# EAGLE design merge (EAGLE 7.5.0)

## Sheet 1 of 10

## Sheet 2 of 10
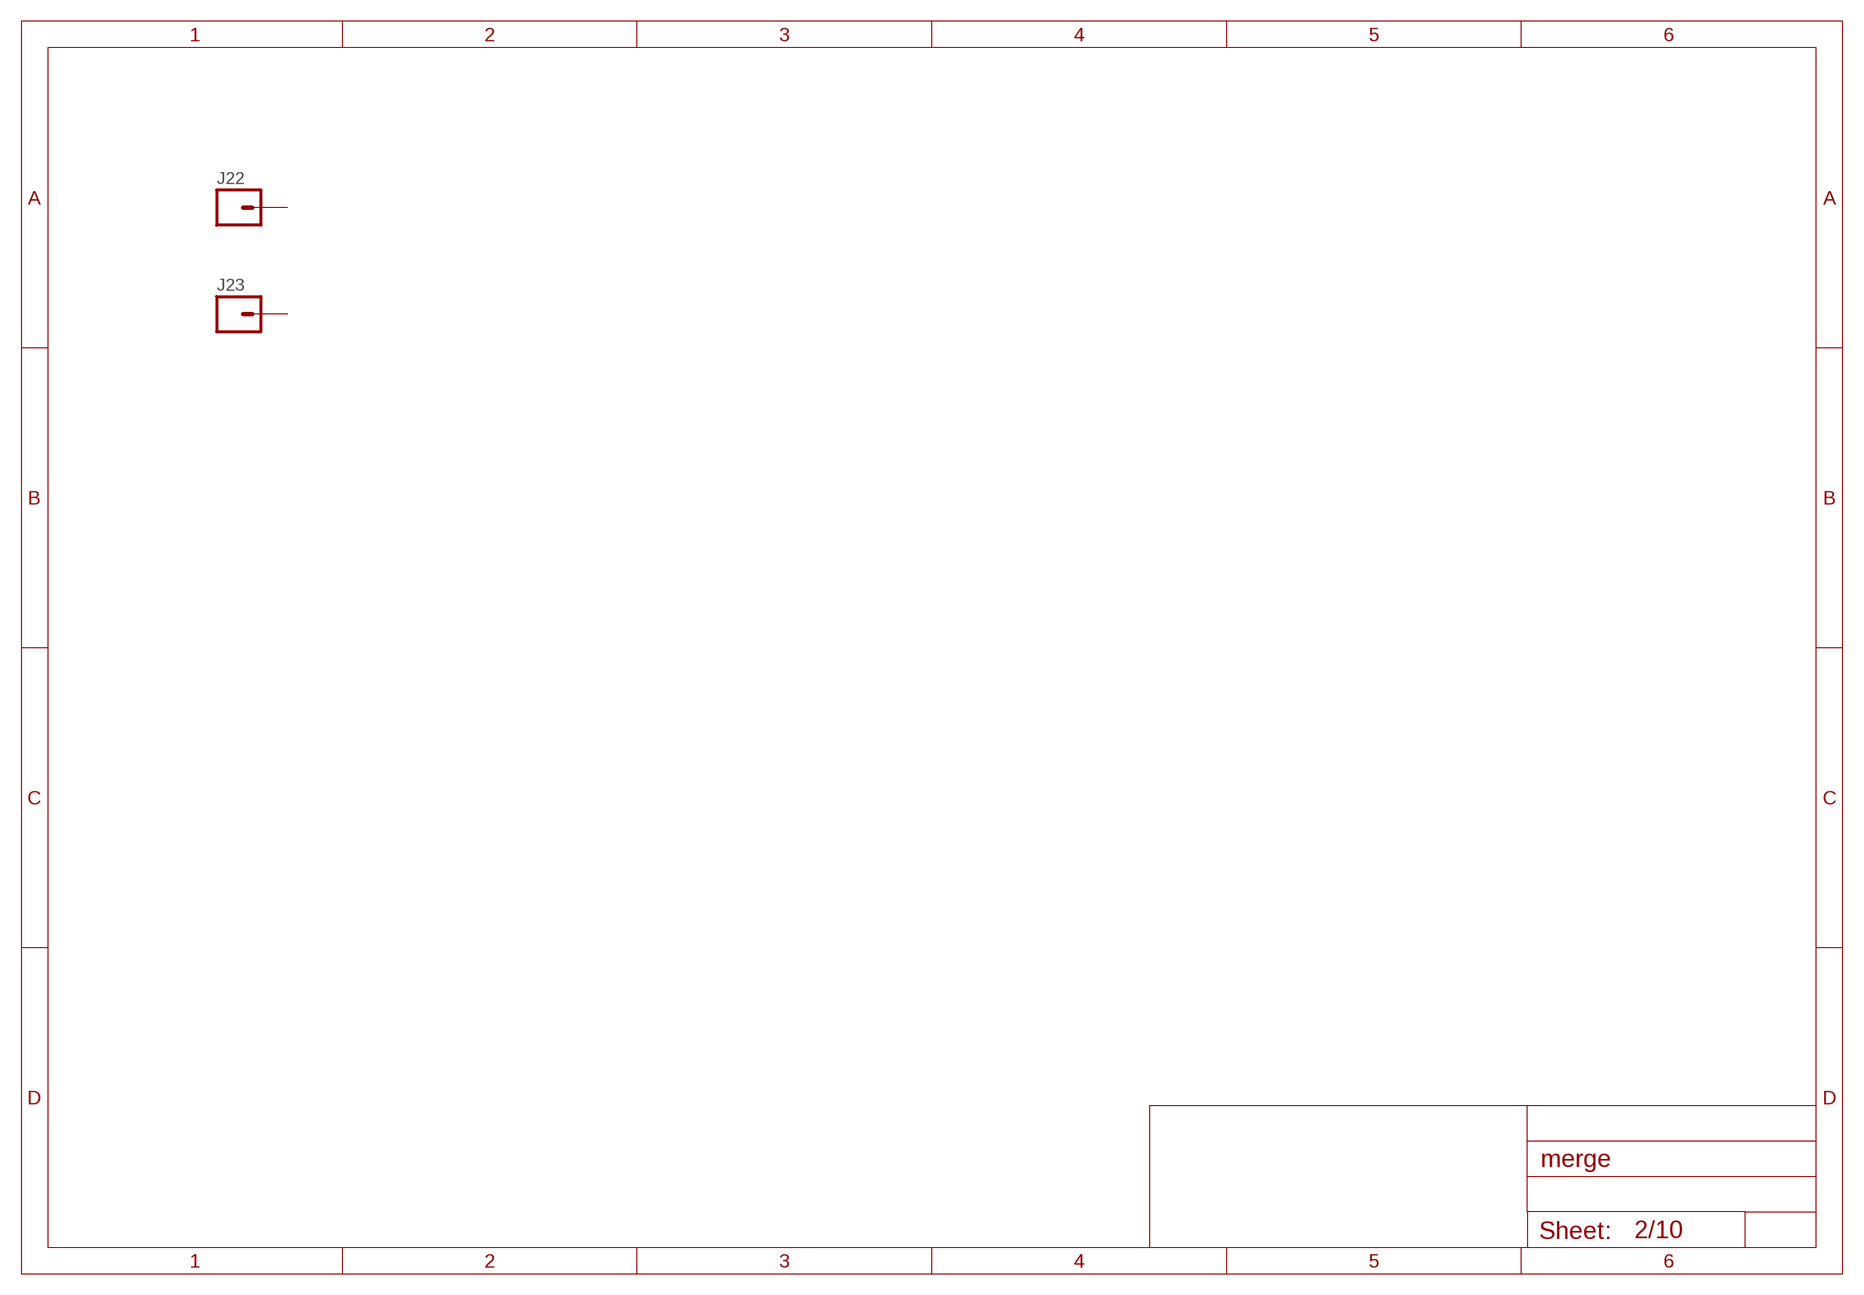
[diagram p0: schematic, sheet 2]

### Parts
J22  M01  [1X01_BIG]
J23  M01  [1X01_BIG]
Unconnected: J22.1 J23.1

## Sheet 3 of 10
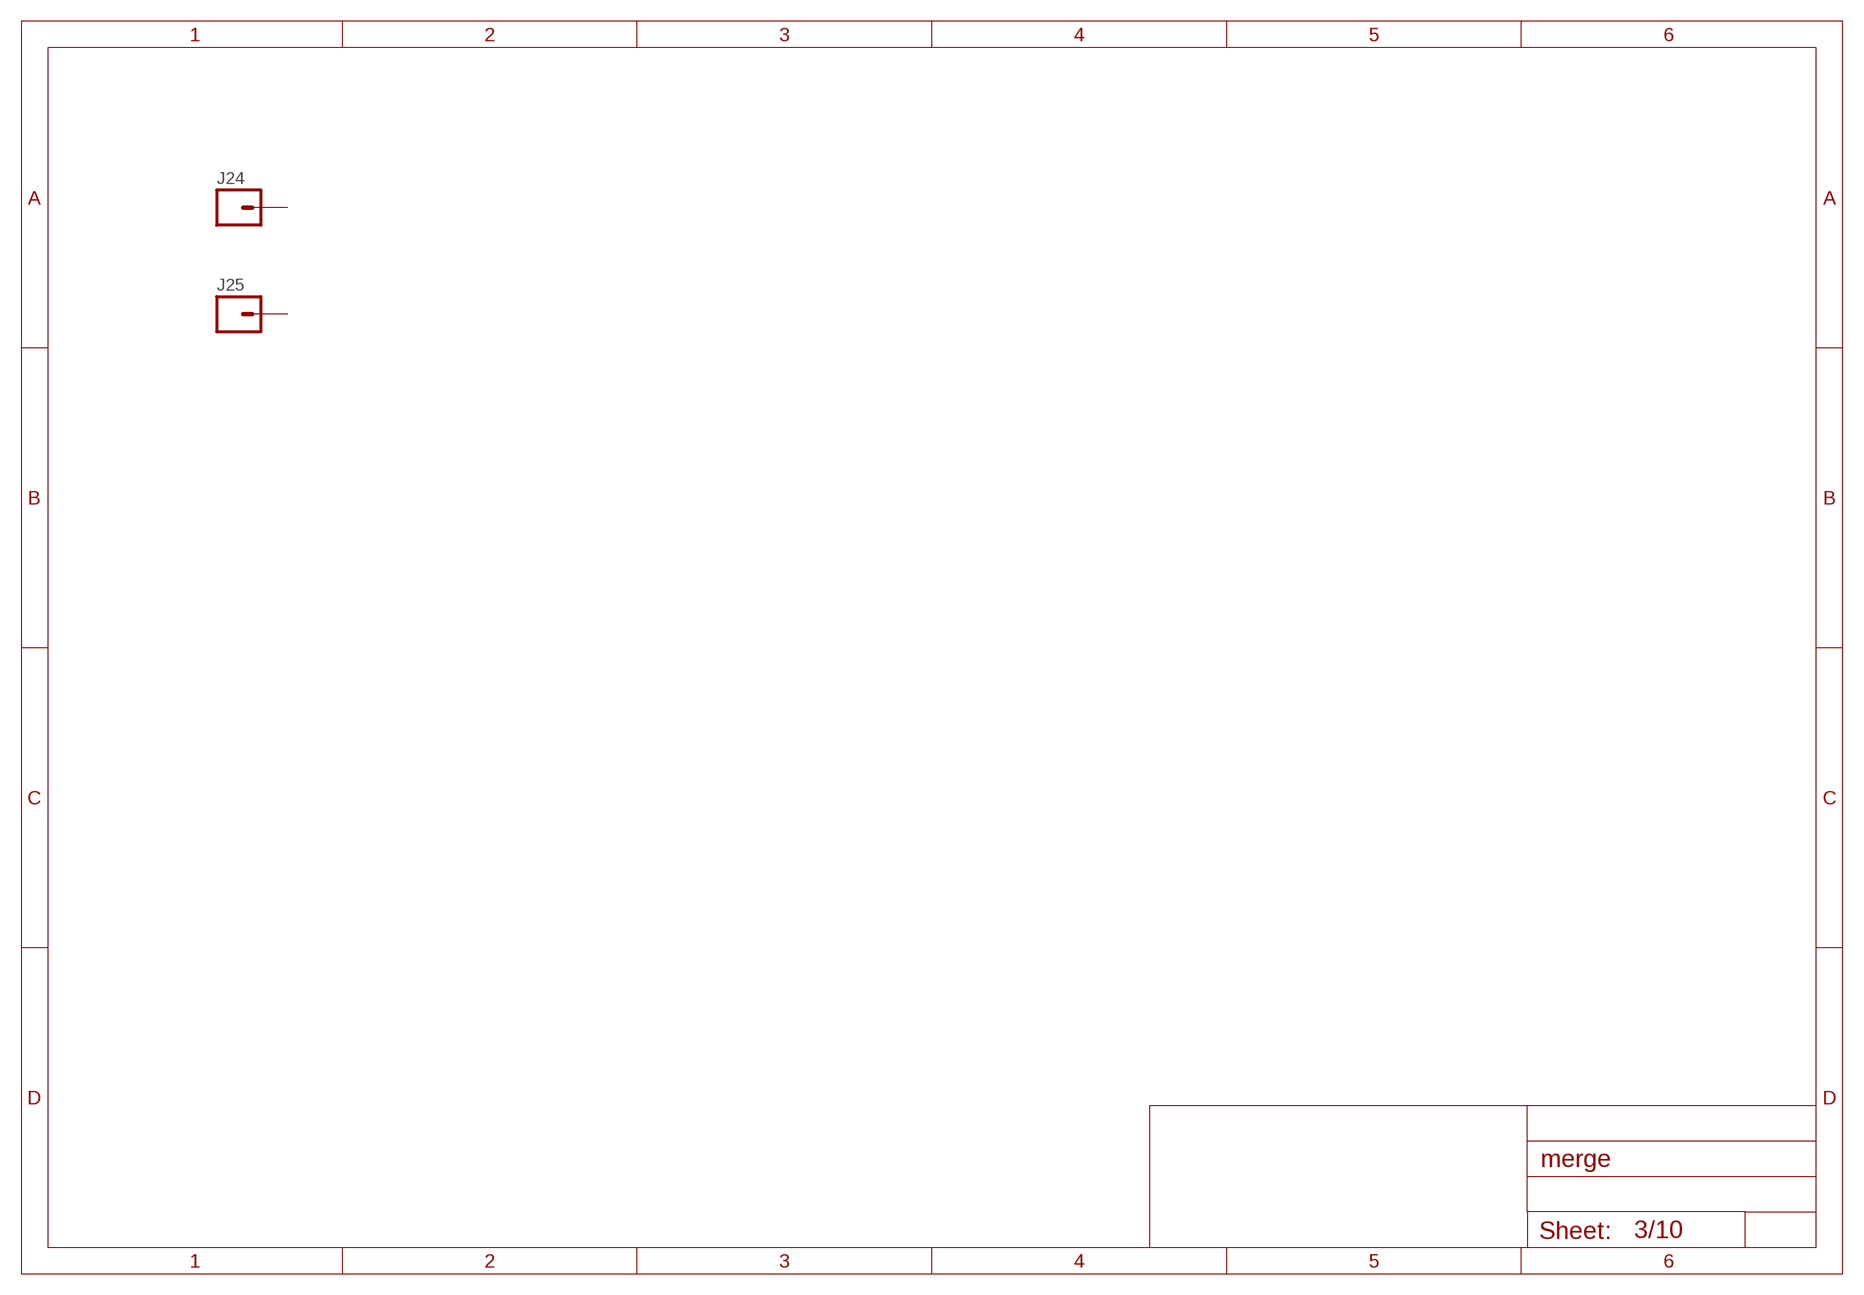
[diagram p1: schematic, sheet 3]

### Parts
J24  M01  [1X01_BIG]
J25  M01  [1X01_BIG]
Unconnected: J24.1 J25.1

## Sheet 4 of 10
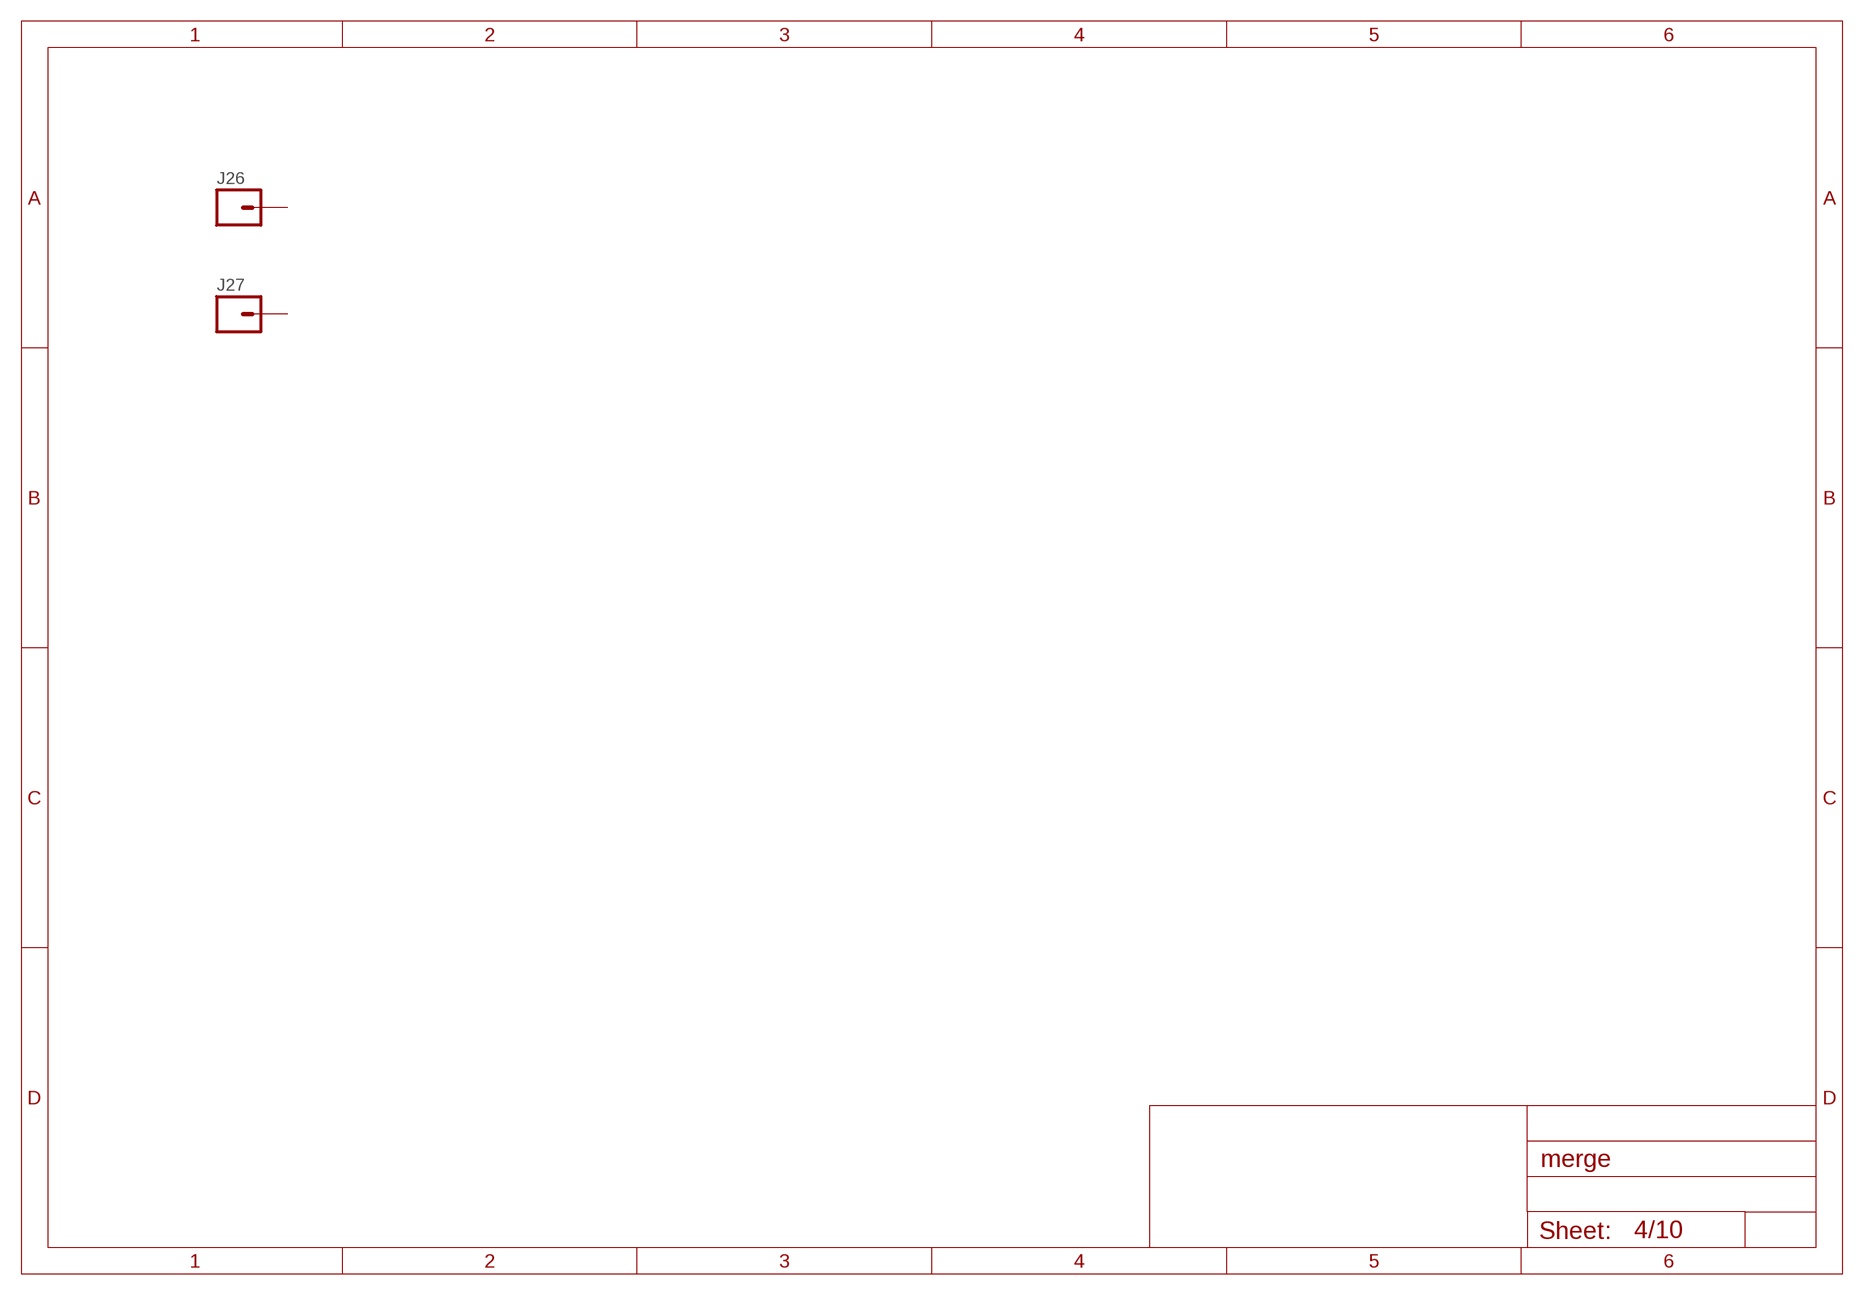
[diagram p2: schematic, sheet 4]

### Parts
J26  M01  [1X01_BIG]
J27  M01  [1X01_BIG]
Unconnected: J26.1 J27.1

## Sheet 5 of 10
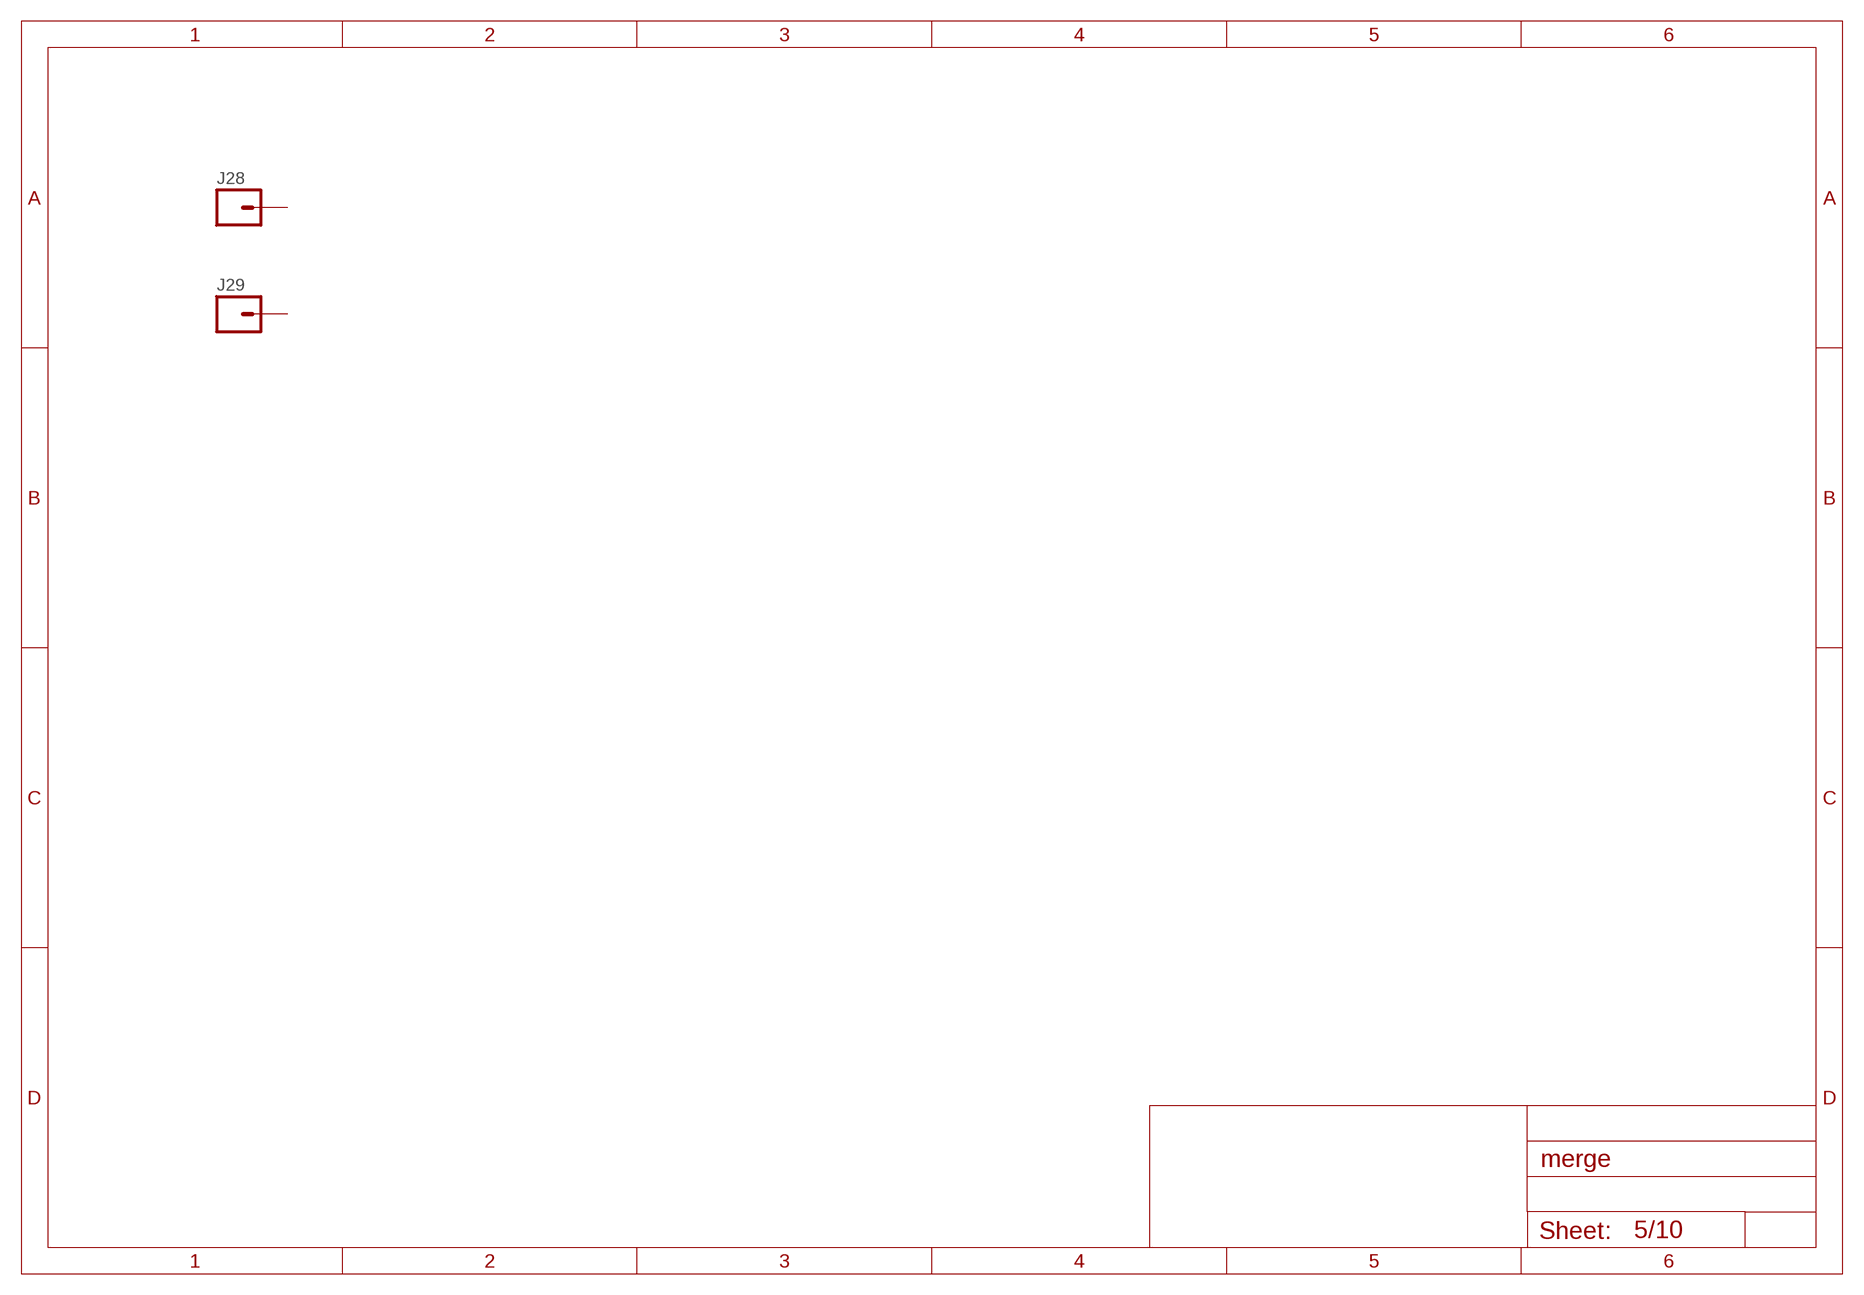
[diagram p3: schematic, sheet 5]

### Parts
J28  M01  [1X01_BIG]
J29  M01  [1X01_BIG]
Unconnected: J28.1 J29.1

## Sheet 6 of 10
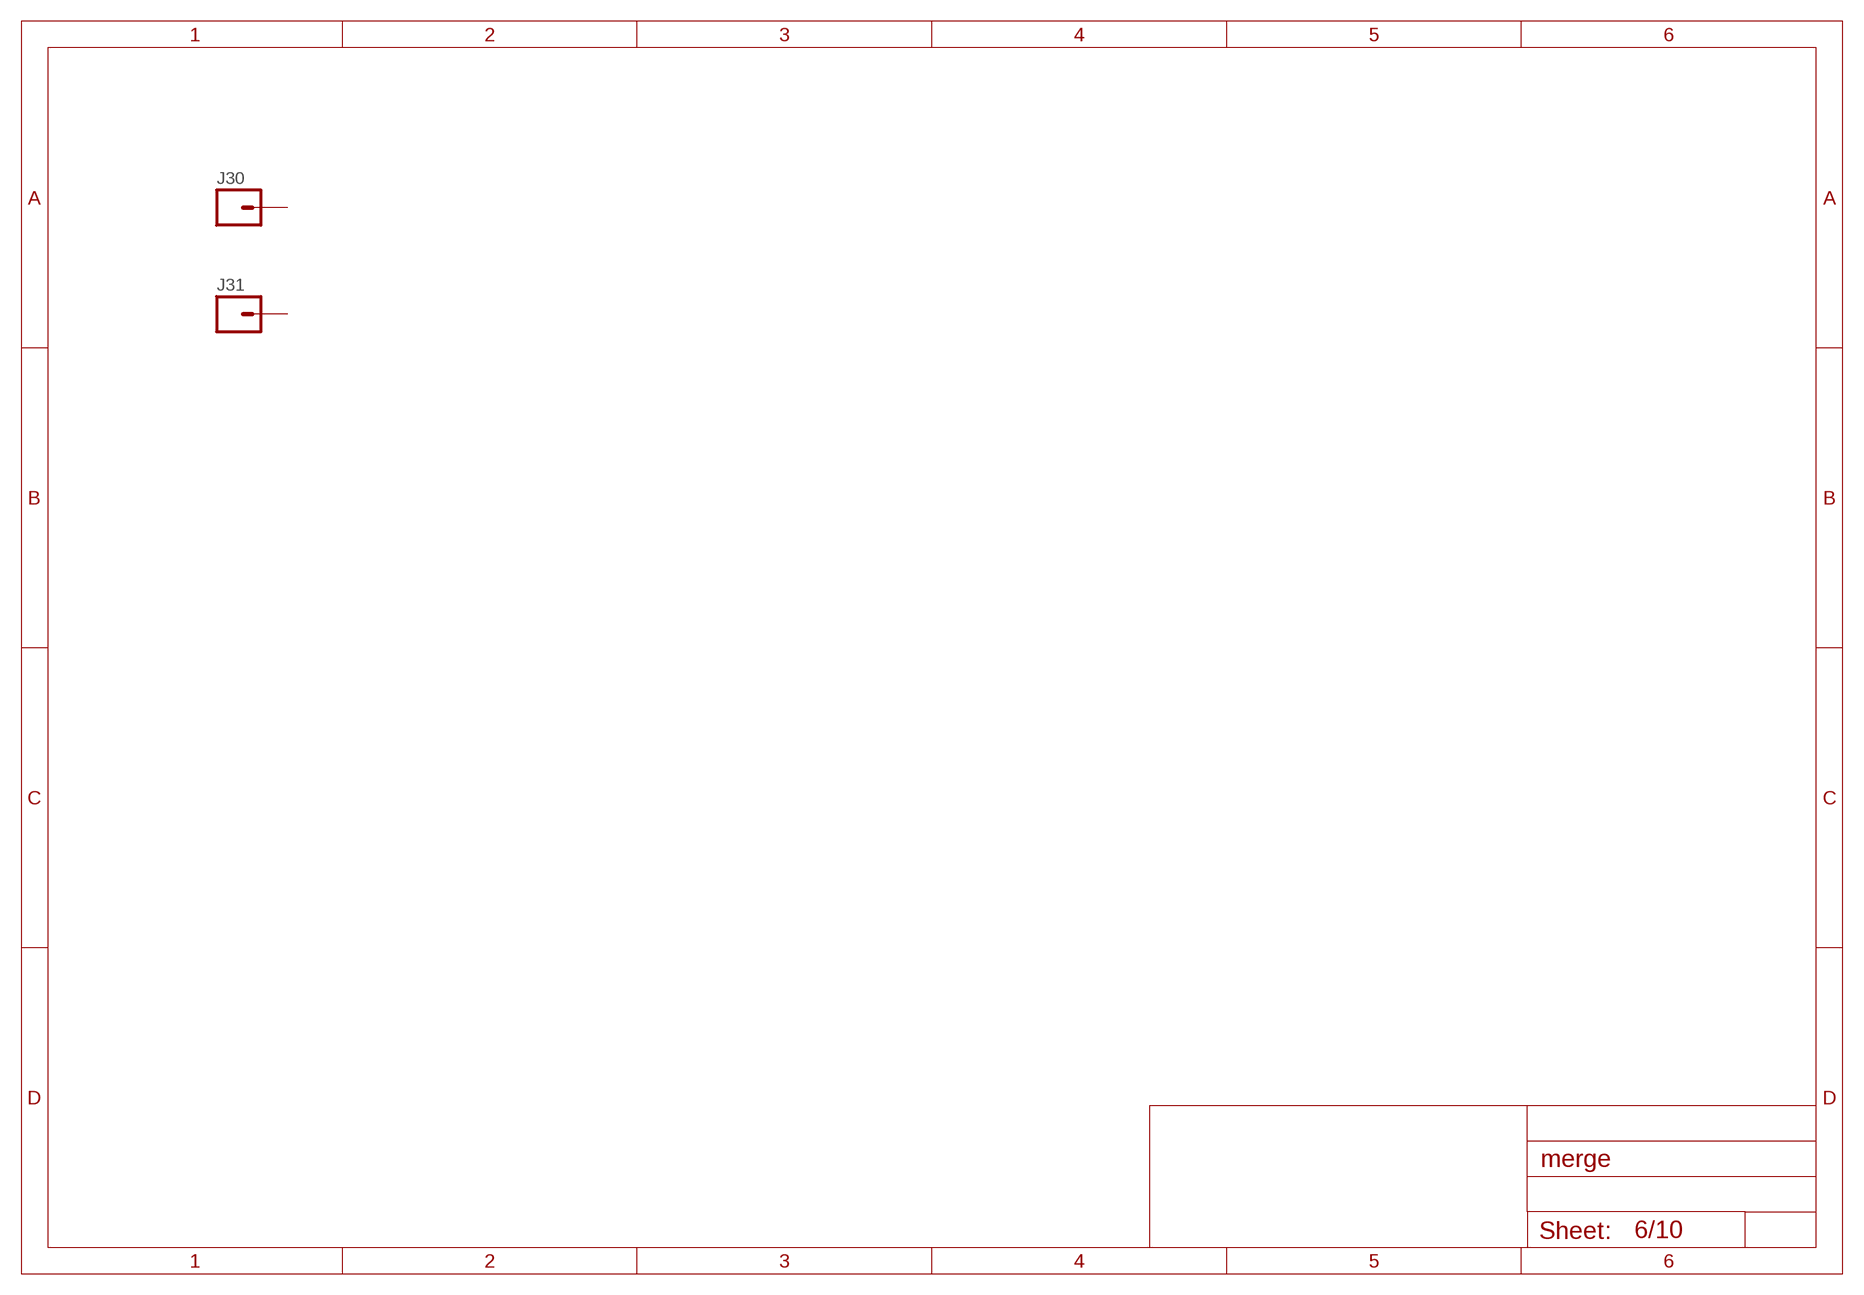
[diagram p4: schematic, sheet 6]

### Parts
J30  M01  [1X01_BIG]
J31  M01  [1X01_BIG]
Unconnected: J30.1 J31.1

## Sheet 7 of 10
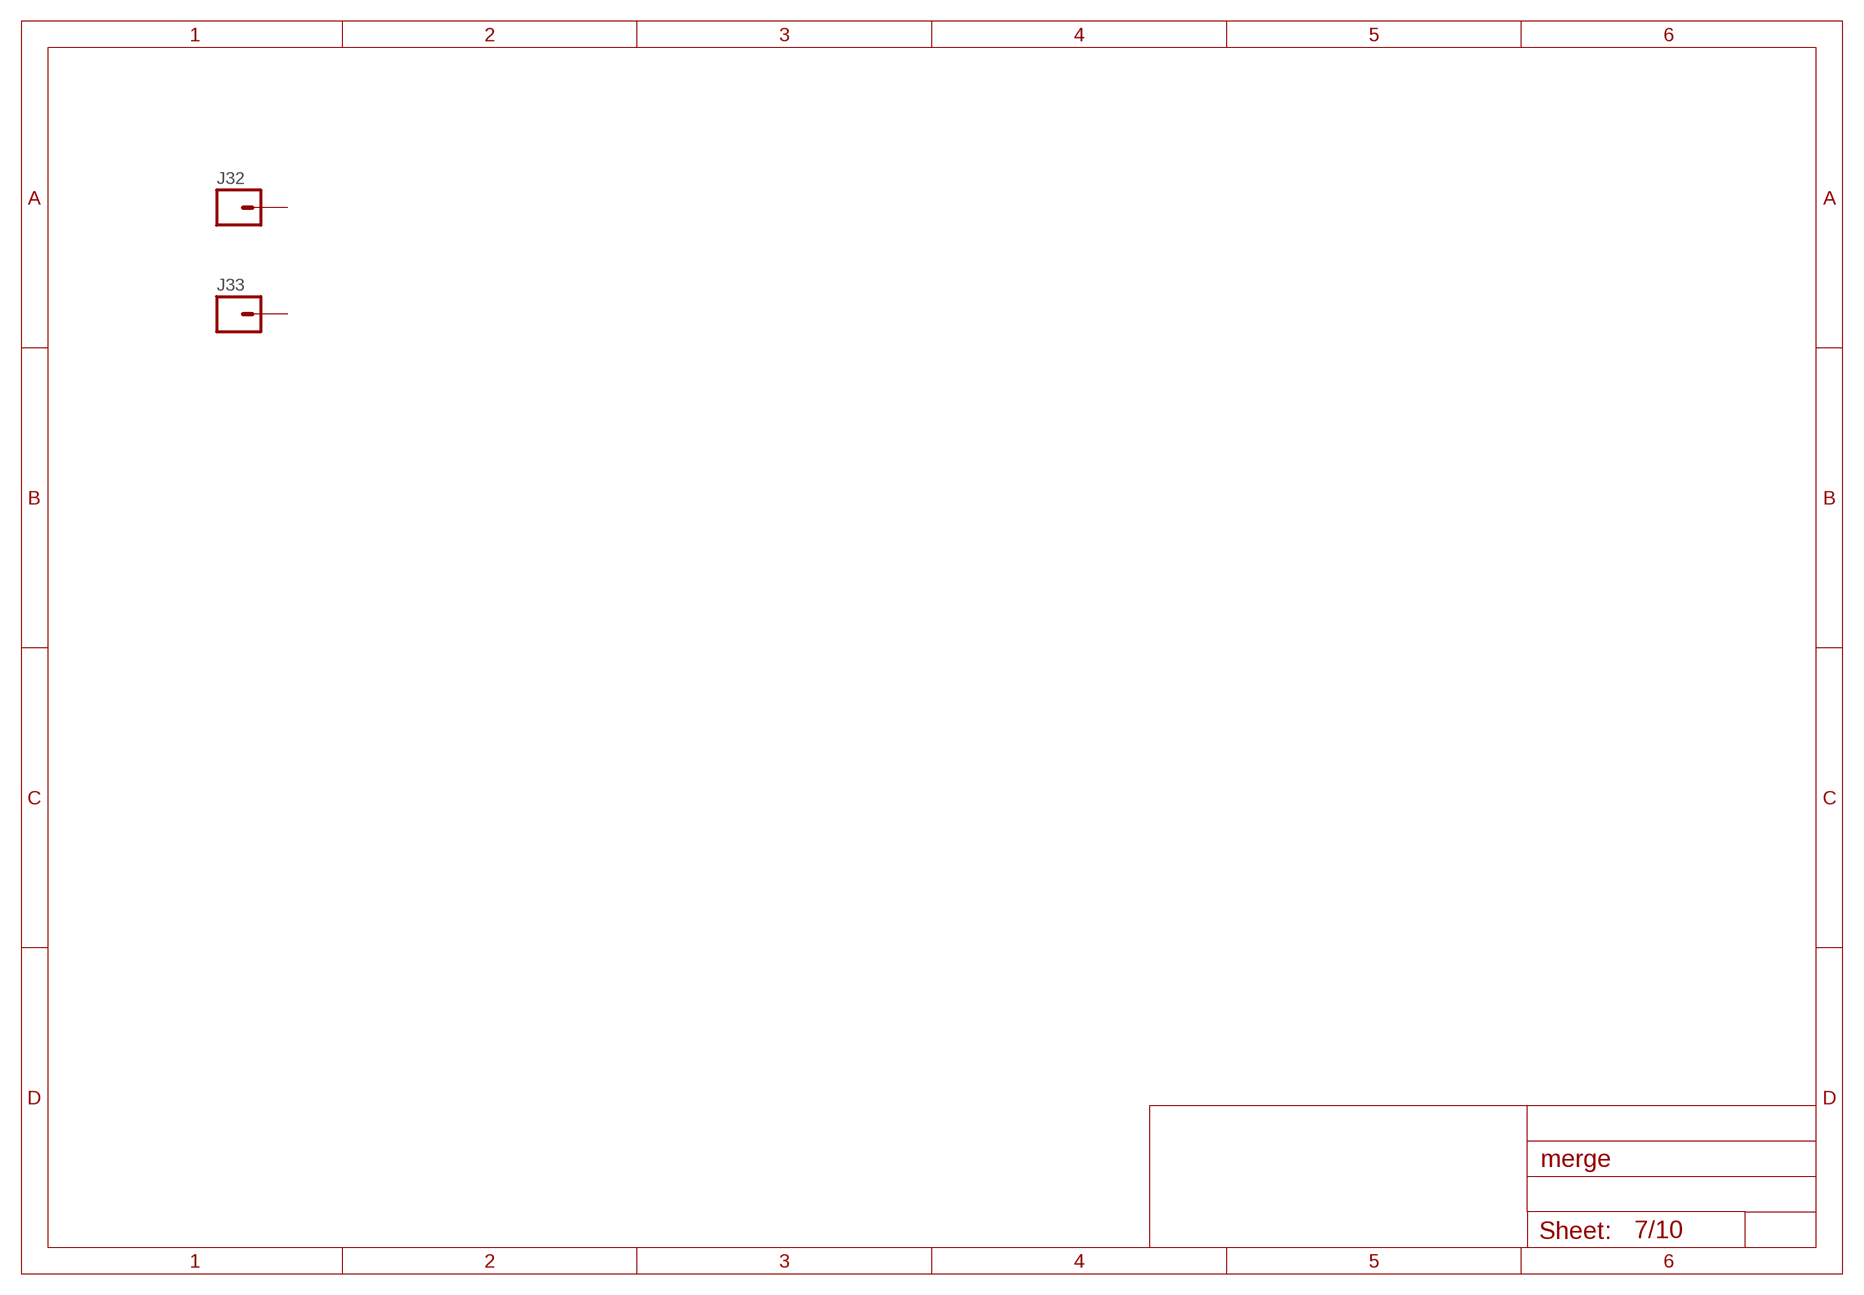
[diagram p5: schematic, sheet 7]

### Parts
J32  M01  [1X01_BIG]
J33  M01  [1X01_BIG]
Unconnected: J32.1 J33.1

## Sheet 8 of 10
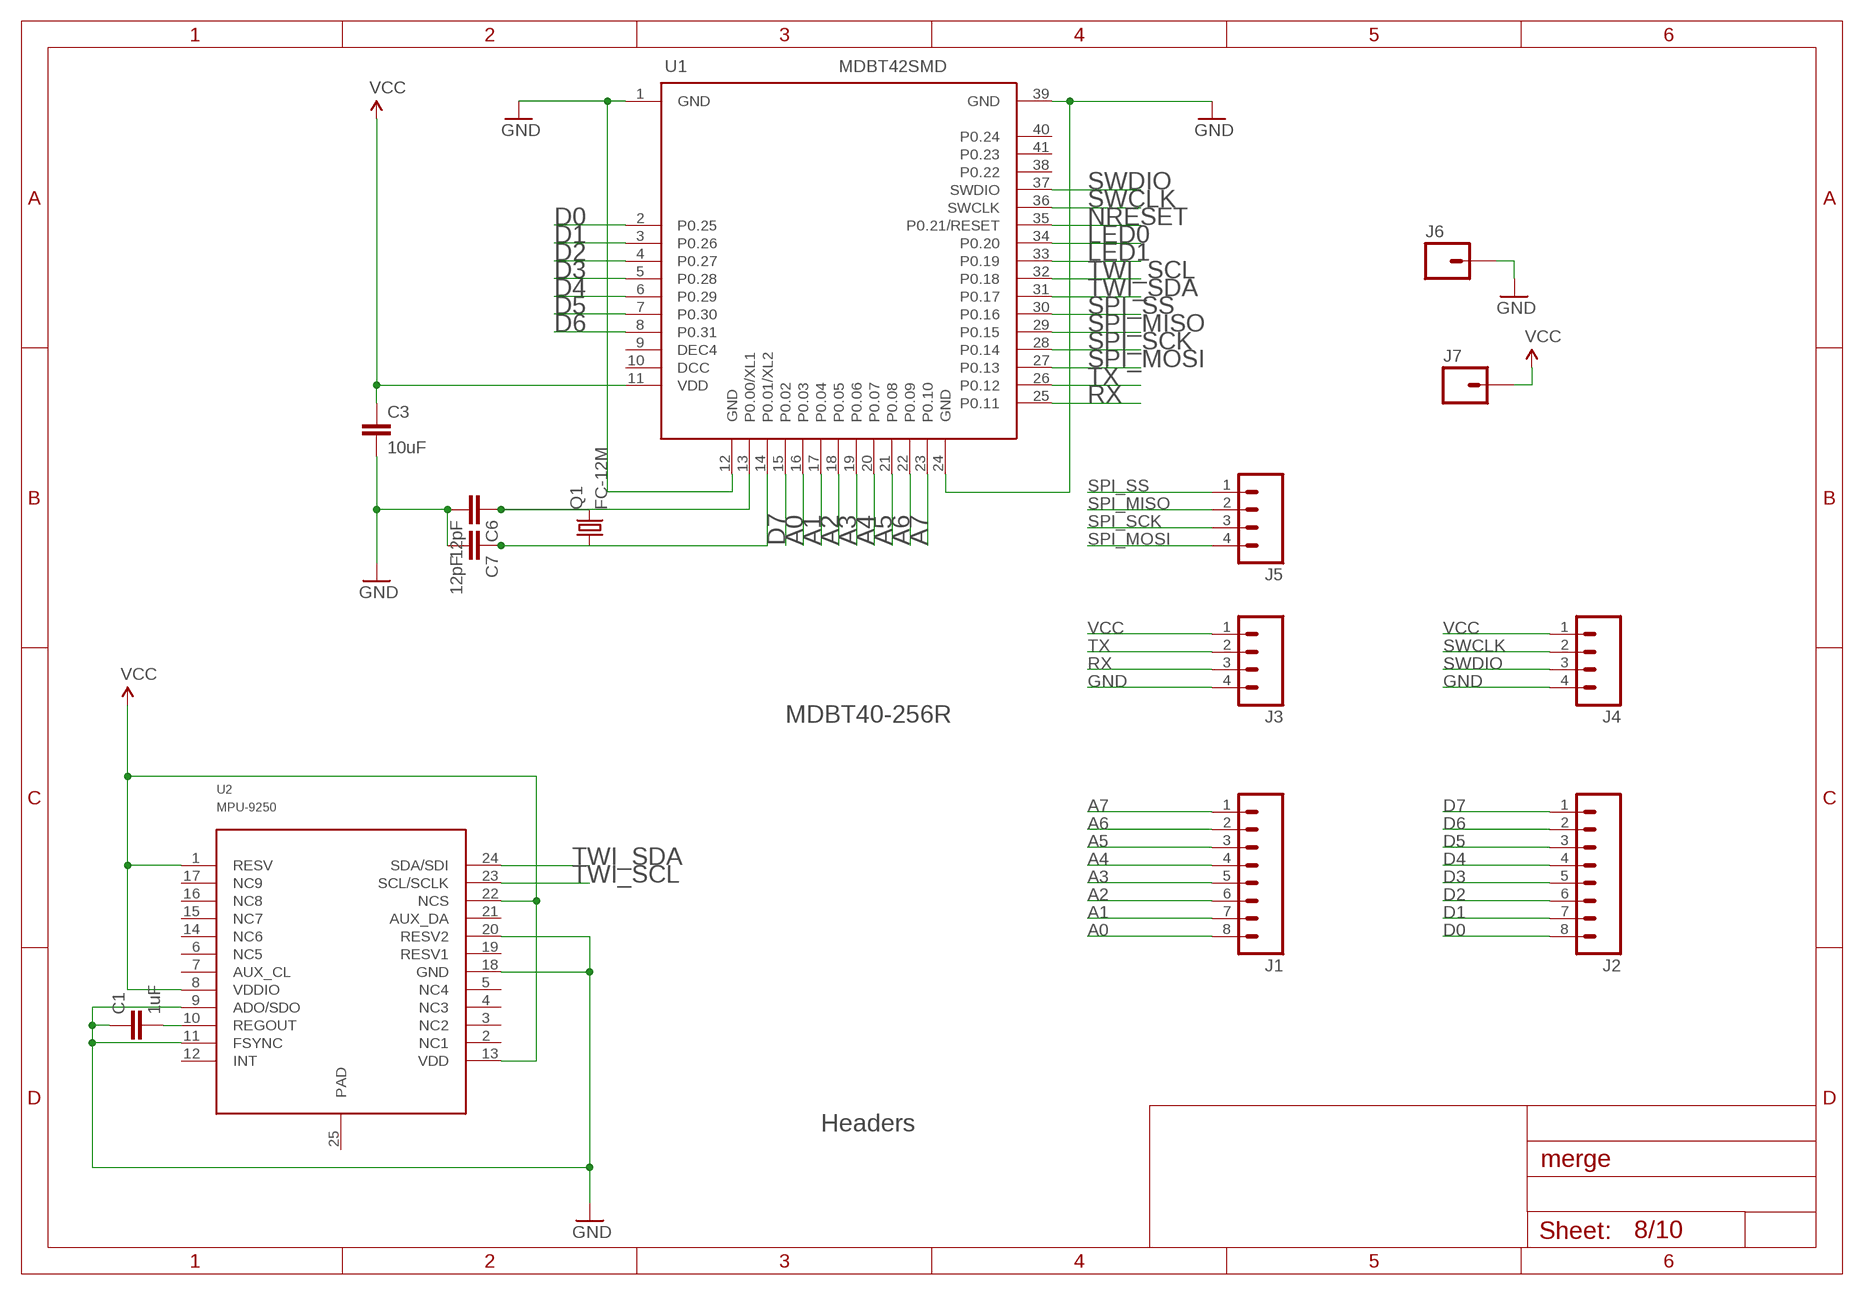
[diagram p6: schematic, sheet 8]

### Parts
C1  1uF  CAP0603-CAP  [0603-CAP]
C3  10uF  CAP0603-CAP  [0603-CAP]
C6  12pF  CAP0603-CAP  [0603-CAP]
C7  12pF  CAP0603-CAP  [0603-CAP]
J1  M08SILK_FEMALE_PTH  [1X08]
J2  M08SILK_FEMALE_PTH  [1X08]
J3  M04PTH  [1X04]
J4  M04PTH  [1X04]
J5  M04PTH  [1X04]
J6  M01_SMDSMD_4X2  [1X01_SMD]
J7  M01_SMDSMD_4X2  [1X01_SMD]
Q1  FC-12M  [FC-12M]
U1  MDBT42SMD  [MDBT42]
U2  MPU-9250  [LEAD-QFN24]

### Nets
A0: J1.8 U1.16(P0.03) ; also sheet 9,10
A1: J1.7 U1.17(P0.04) ; also sheet 9,10
A2: J1.6 U1.18(P0.05) ; also sheet 9,10
A3: J1.5 U1.19(P0.06) ; also sheet 9,10
A4: J1.4 U1.20(P0.07) ; also sheet 9,10
A5: J1.3 U1.21(P0.08) ; also sheet 9,10
A6: J1.2 U1.22(P0.09) ; also sheet 9,10
A7: J1.1 U1.23(P0.10) ; also sheet 9,10
D0: J2.8 U1.2(P0.25) ; also sheet 9,10
D1: J2.7 U1.3(P0.26) ; also sheet 9,10
D2: J2.6 U1.4(P0.27) ; also sheet 9,10
D3: J2.5 U1.5(P0.28) ; also sheet 9,10
D4: J2.4 U1.6(P0.29) ; also sheet 9,10
D5: J2.3 U1.7(P0.30) ; also sheet 9,10
D6: J2.2 U1.8(P0.31) ; also sheet 9,10
D7: J2.1 U1.15(P0.02) ; also sheet 9,10
GND: C1.1 C3.2 C6.2 C7.2 J3.4 J4.4 J6.P$1 U1.1(GND) U1.12(GND) U1.24(GND) U1.39(GND) U2.9(ADO/SDO) U2.11(FSYNC) U2.18(GND) U2.20(RESV2) ; also sheet 9,10
LED0: U1.34(P0.20) ; also sheet 9,10
LED1: U1.33(P0.19) ; also sheet 9,10
N$2: C7.1 Q1.1 U1.14(P0.01/XL2)
N$3: C6.1 Q1.2 U1.13(P0.00/XL1)
N$5: C1.2 U2.10(REGOUT)
NRESET: U1.35(P0.21/RESET) ; also sheet 9,10
RX: J3.3 U1.25(P0.11) ; also sheet 9,10
SPI_MISO: J5.2 U1.29(P0.15) ; also sheet 9,10
SPI_MOSI: J5.4 U1.27(P0.13) ; also sheet 9,10
SPI_SCK: J5.3 U1.28(P0.14) ; also sheet 9,10
SPI_SS: J5.1 U1.30(P0.16) ; also sheet 9,10
SWCLK: J4.2 U1.36(SWCLK) ; also sheet 9,10
SWDIO: J4.3 U1.37(SWDIO) ; also sheet 9,10
TWI_SCL: U1.32(P0.18) U2.23(SCL/SCLK) ; also sheet 9,10
TWI_SDA: U1.31(P0.17) U2.24(SDA/SDI) ; also sheet 9,10
TX: J3.2 U1.26(P0.12) ; also sheet 9,10
VCC: C3.1 J3.1 J4.1 J7.P$1 U1.11(VDD) U2.1(RESV) U2.8(VDDIO) U2.13(VDD) U2.22(NCS) ; also sheet 9,10
Unconnected: U1.9(DEC4) U1.10(DCC) U1.38(P0.22) U1.40(P0.24) U1.41(P0.23) U2.2(NC1) U2.3(NC2) U2.4(NC3) U2.5(NC4) U2.6(NC5) U2.7(AUX_CL) U2.12(INT) U2.14(NC6) U2.15(NC7) U2.16(NC8) U2.17(NC9) U2.19(RESV1) U2.21(AUX_DA) U2.25(PAD)

### Notes on the sheet
- MDBT40-256R
- Headers

## Sheet 9 of 10
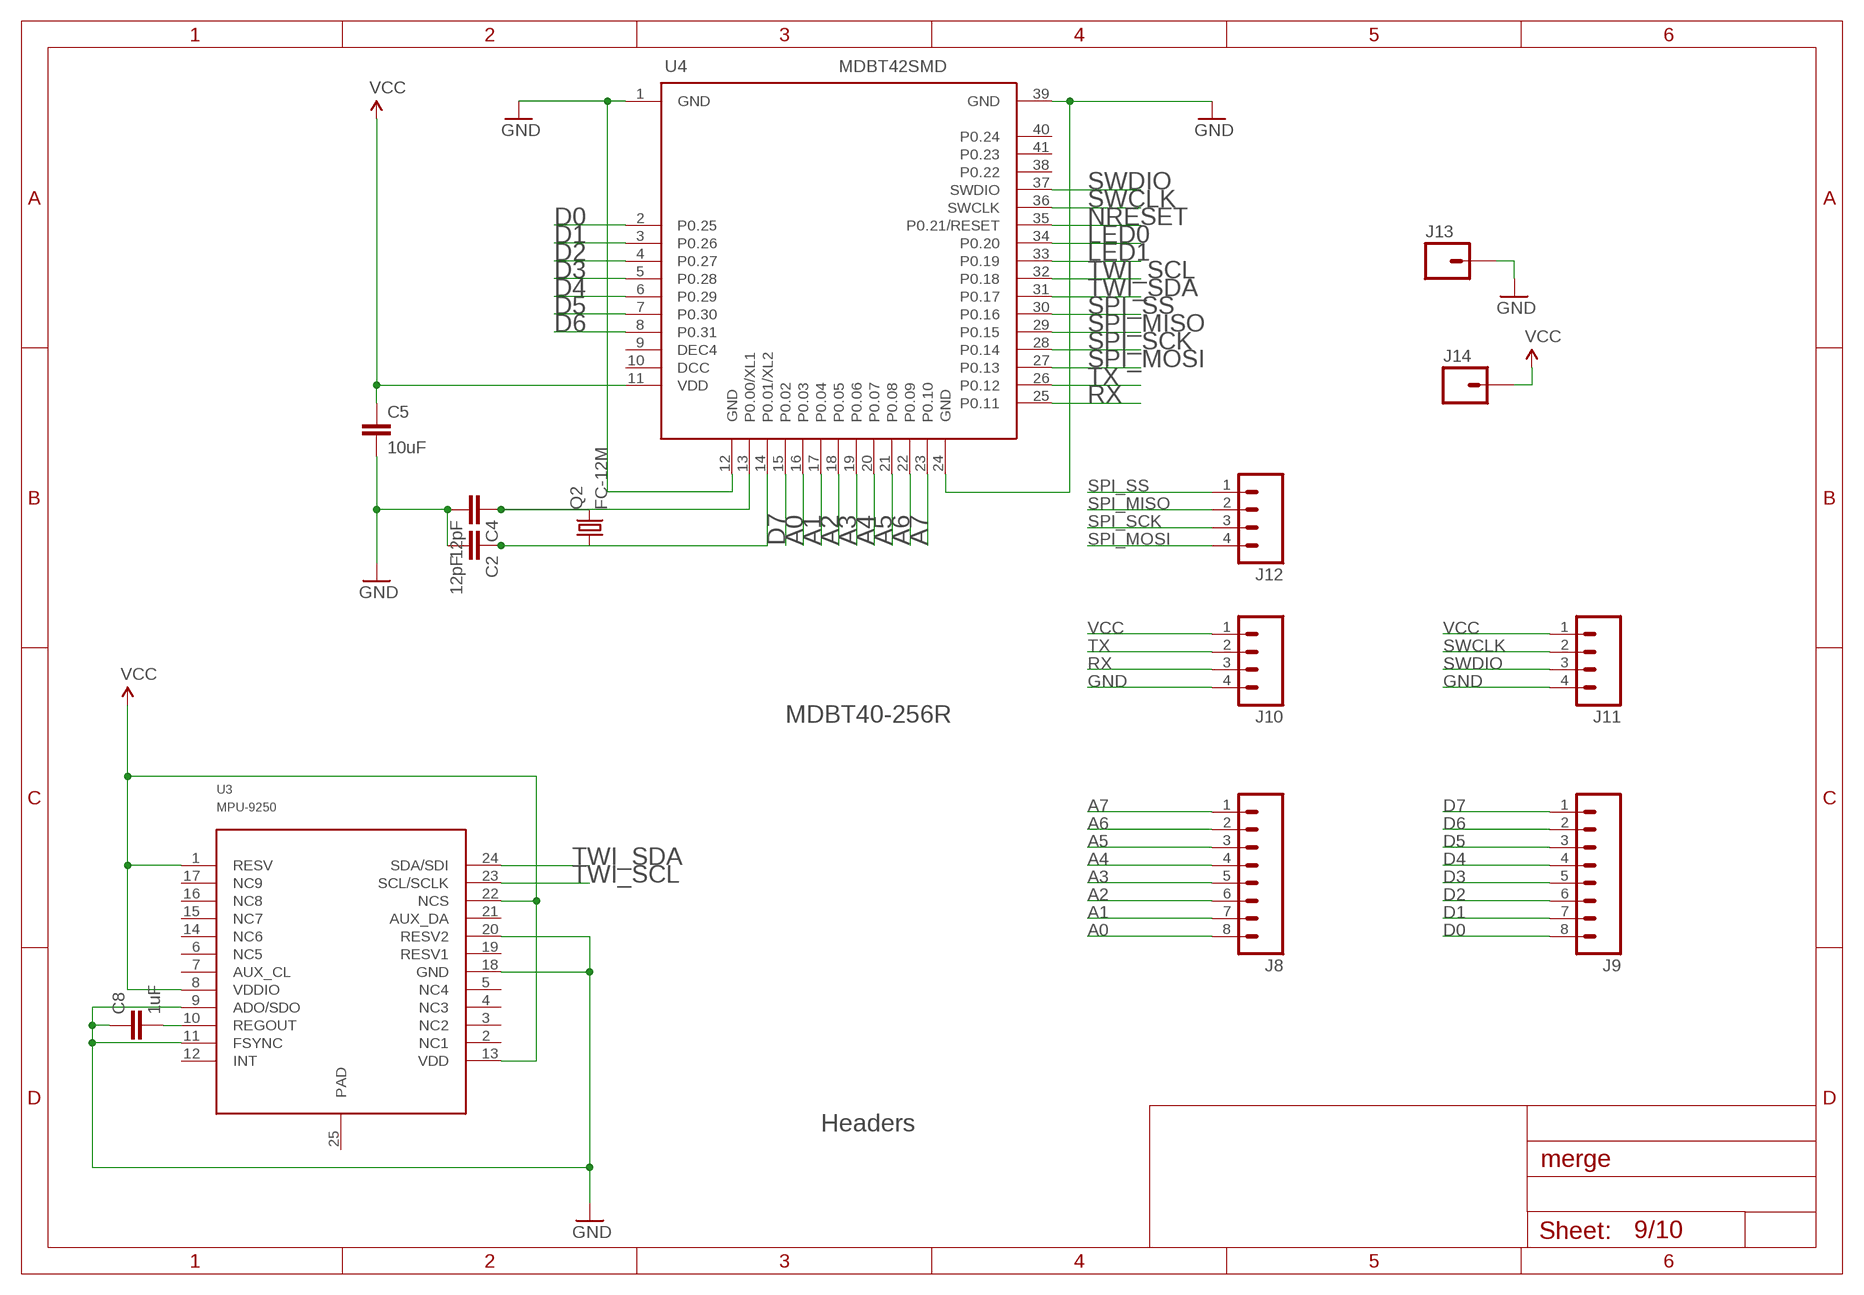
[diagram p7: schematic, sheet 9]

### Parts
C2  12pF  CAP0603-CAP  [0603-CAP]
C4  12pF  CAP0603-CAP  [0603-CAP]
C5  10uF  CAP0603-CAP  [0603-CAP]
C8  1uF  CAP0603-CAP  [0603-CAP]
J8  M08SILK_FEMALE_PTH  [1X08]
J9  M08SILK_FEMALE_PTH  [1X08]
J10  M04PTH  [1X04]
J11  M04PTH  [1X04]
J12  M04PTH  [1X04]
J13  M01_SMDSMD_4X2  [1X01_SMD]
J14  M01_SMDSMD_4X2  [1X01_SMD]
Q2  FC-12M  [FC-12M]
U3  MPU-9250  [LEAD-QFN24]
U4  MDBT42SMD  [MDBT42]

### Nets
A0: J8.8 U4.16(P0.03) ; also sheet 8,10
A1: J8.7 U4.17(P0.04) ; also sheet 8,10
A2: J8.6 U4.18(P0.05) ; also sheet 8,10
A3: J8.5 U4.19(P0.06) ; also sheet 8,10
A4: J8.4 U4.20(P0.07) ; also sheet 8,10
A5: J8.3 U4.21(P0.08) ; also sheet 8,10
A6: J8.2 U4.22(P0.09) ; also sheet 8,10
A7: J8.1 U4.23(P0.10) ; also sheet 8,10
D0: J9.8 U4.2(P0.25) ; also sheet 8,10
D1: J9.7 U4.3(P0.26) ; also sheet 8,10
D2: J9.6 U4.4(P0.27) ; also sheet 8,10
D3: J9.5 U4.5(P0.28) ; also sheet 8,10
D4: J9.4 U4.6(P0.29) ; also sheet 8,10
D5: J9.3 U4.7(P0.30) ; also sheet 8,10
D6: J9.2 U4.8(P0.31) ; also sheet 8,10
D7: J9.1 U4.15(P0.02) ; also sheet 8,10
GND: C2.2 C4.2 C5.2 C8.1 J10.4 J11.4 J13.P$1 U3.9(ADO/SDO) U3.11(FSYNC) U3.18(GND) U3.20(RESV2) U4.1(GND) U4.12(GND) U4.24(GND) U4.39(GND) ; also sheet 8,10
LED0: U4.34(P0.20) ; also sheet 8,10
LED1: U4.33(P0.19) ; also sheet 8,10
N$64: C2.1 Q2.1 U4.14(P0.01/XL2)
N$100: C4.1 Q2.2 U4.13(P0.00/XL1)
N$101: C8.2 U3.10(REGOUT)
NRESET: U4.35(P0.21/RESET) ; also sheet 8,10
RX: J10.3 U4.25(P0.11) ; also sheet 8,10
SPI_MISO: J12.2 U4.29(P0.15) ; also sheet 8,10
SPI_MOSI: J12.4 U4.27(P0.13) ; also sheet 8,10
SPI_SCK: J12.3 U4.28(P0.14) ; also sheet 8,10
SPI_SS: J12.1 U4.30(P0.16) ; also sheet 8,10
SWCLK: J11.2 U4.36(SWCLK) ; also sheet 8,10
SWDIO: J11.3 U4.37(SWDIO) ; also sheet 8,10
TWI_SCL: U3.23(SCL/SCLK) U4.32(P0.18) ; also sheet 8,10
TWI_SDA: U3.24(SDA/SDI) U4.31(P0.17) ; also sheet 8,10
TX: J10.2 U4.26(P0.12) ; also sheet 8,10
VCC: C5.1 J10.1 J11.1 J14.P$1 U3.1(RESV) U3.8(VDDIO) U3.13(VDD) U3.22(NCS) U4.11(VDD) ; also sheet 8,10
Unconnected: U3.2(NC1) U3.3(NC2) U3.4(NC3) U3.5(NC4) U3.6(NC5) U3.7(AUX_CL) U3.12(INT) U3.14(NC6) U3.15(NC7) U3.16(NC8) U3.17(NC9) U3.19(RESV1) U3.21(AUX_DA) U3.25(PAD) U4.9(DEC4) U4.10(DCC) U4.38(P0.22) U4.40(P0.24) U4.41(P0.23)

### Notes on the sheet
- MDBT40-256R
- Headers

## Sheet 10 of 10
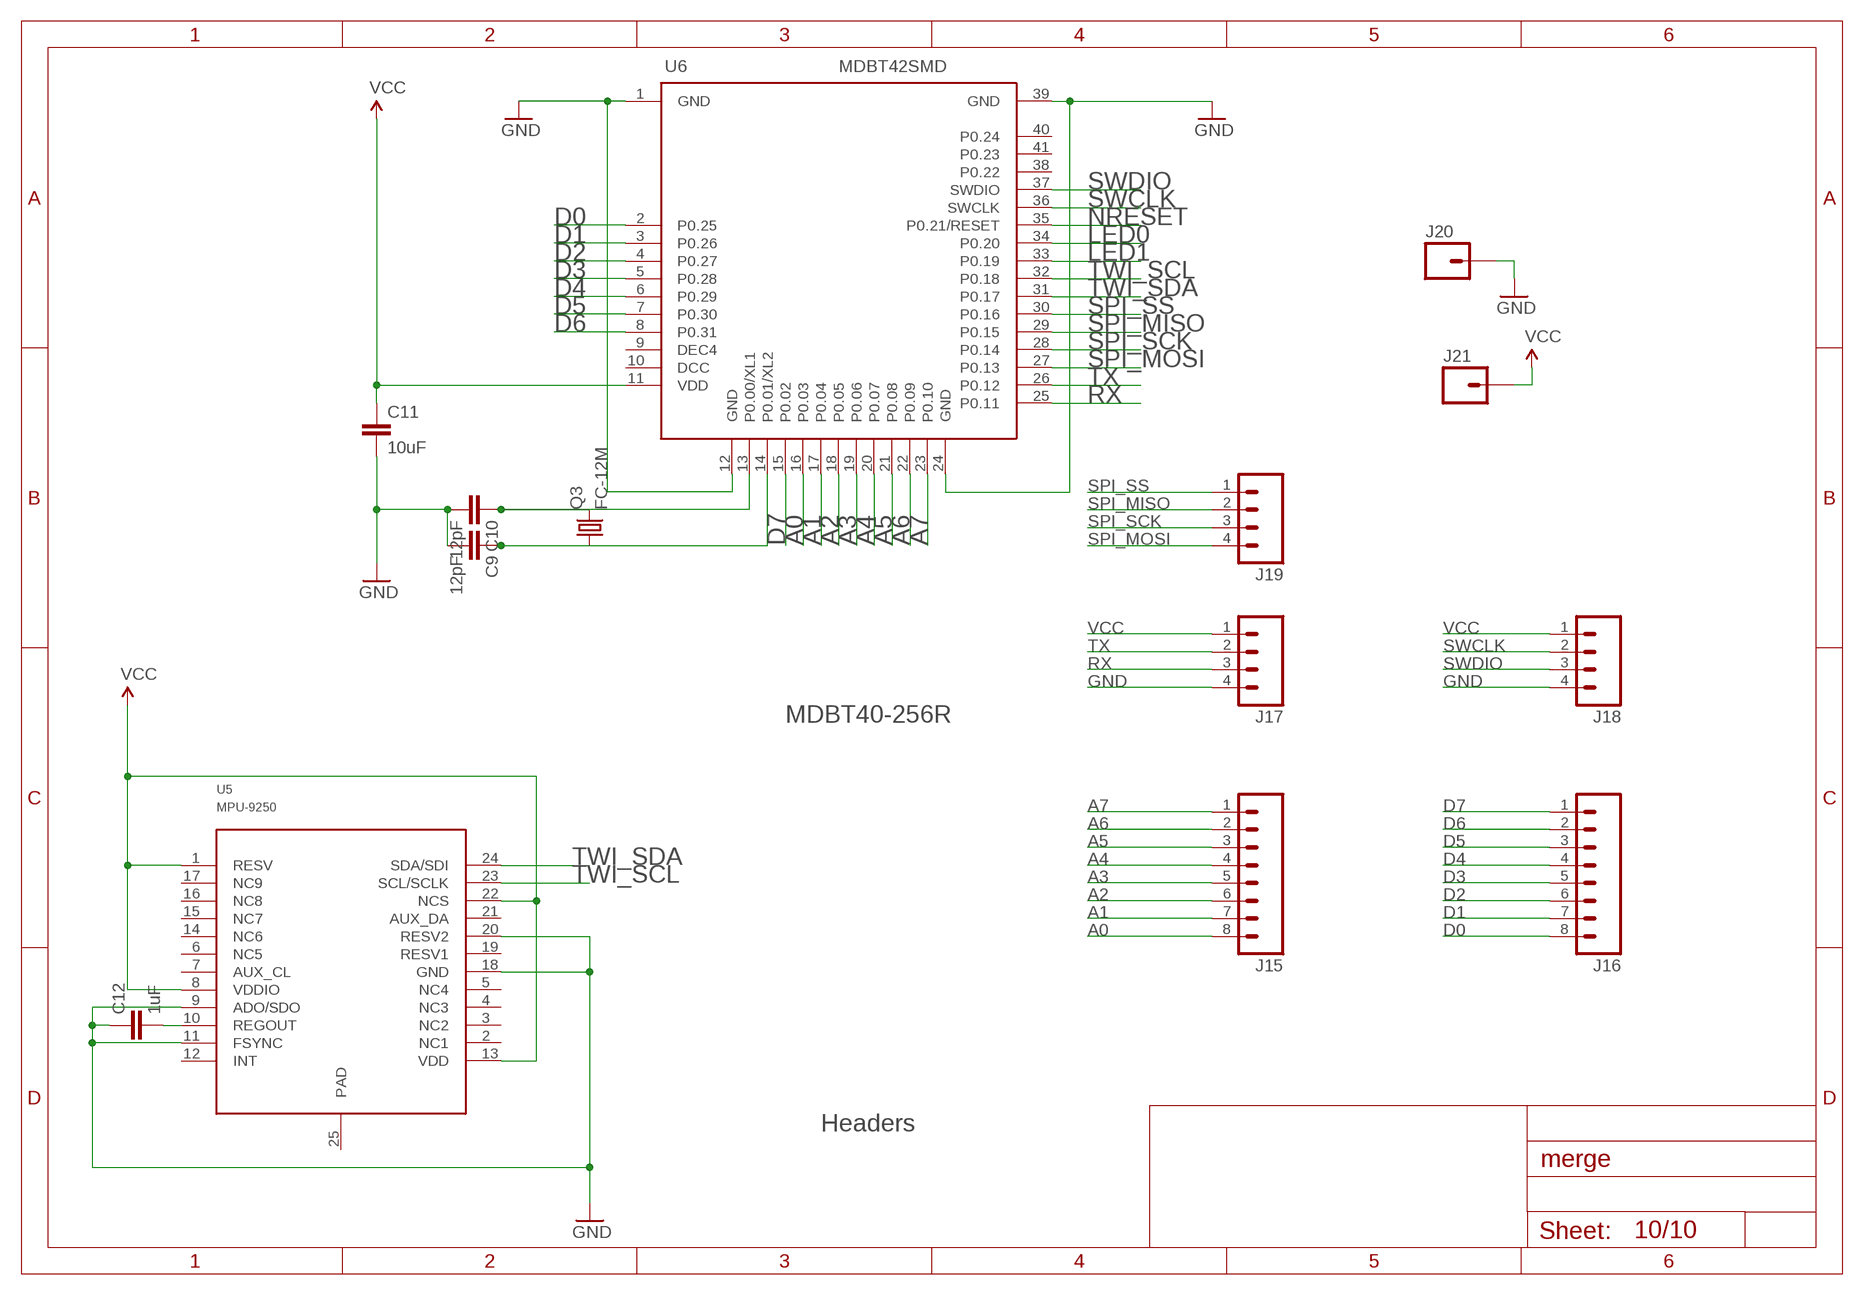
[diagram p8: schematic, sheet 10]

### Parts
C9  12pF  CAP0603-CAP  [0603-CAP]
C10  12pF  CAP0603-CAP  [0603-CAP]
C11  10uF  CAP0603-CAP  [0603-CAP]
C12  1uF  CAP0603-CAP  [0603-CAP]
J15  M08SILK_FEMALE_PTH  [1X08]
J16  M08SILK_FEMALE_PTH  [1X08]
J17  M04PTH  [1X04]
J18  M04PTH  [1X04]
J19  M04PTH  [1X04]
J20  M01_SMDSMD_4X2  [1X01_SMD]
J21  M01_SMDSMD_4X2  [1X01_SMD]
Q3  FC-12M  [FC-12M]
U5  MPU-9250  [LEAD-QFN24]
U6  MDBT42SMD  [MDBT42]

### Nets
A0: J15.8 U6.16(P0.03) ; also sheet 8,9
A1: J15.7 U6.17(P0.04) ; also sheet 8,9
A2: J15.6 U6.18(P0.05) ; also sheet 8,9
A3: J15.5 U6.19(P0.06) ; also sheet 8,9
A4: J15.4 U6.20(P0.07) ; also sheet 8,9
A5: J15.3 U6.21(P0.08) ; also sheet 8,9
A6: J15.2 U6.22(P0.09) ; also sheet 8,9
A7: J15.1 U6.23(P0.10) ; also sheet 8,9
D0: J16.8 U6.2(P0.25) ; also sheet 8,9
D1: J16.7 U6.3(P0.26) ; also sheet 8,9
D2: J16.6 U6.4(P0.27) ; also sheet 8,9
D3: J16.5 U6.5(P0.28) ; also sheet 8,9
D4: J16.4 U6.6(P0.29) ; also sheet 8,9
D5: J16.3 U6.7(P0.30) ; also sheet 8,9
D6: J16.2 U6.8(P0.31) ; also sheet 8,9
D7: J16.1 U6.15(P0.02) ; also sheet 8,9
GND: C9.2 C10.2 C11.2 C12.1 J17.4 J18.4 J20.P$1 U5.9(ADO/SDO) U5.11(FSYNC) U5.18(GND) U5.20(RESV2) U6.1(GND) U6.12(GND) U6.24(GND) U6.39(GND) ; also sheet 8,9
LED0: U6.34(P0.20) ; also sheet 8,9
LED1: U6.33(P0.19) ; also sheet 8,9
N$107: C9.1 Q3.1 U6.14(P0.01/XL2)
N$108: C10.1 Q3.2 U6.13(P0.00/XL1)
N$109: C12.2 U5.10(REGOUT)
NRESET: U6.35(P0.21/RESET) ; also sheet 8,9
RX: J17.3 U6.25(P0.11) ; also sheet 8,9
SPI_MISO: J19.2 U6.29(P0.15) ; also sheet 8,9
SPI_MOSI: J19.4 U6.27(P0.13) ; also sheet 8,9
SPI_SCK: J19.3 U6.28(P0.14) ; also sheet 8,9
SPI_SS: J19.1 U6.30(P0.16) ; also sheet 8,9
SWCLK: J18.2 U6.36(SWCLK) ; also sheet 8,9
SWDIO: J18.3 U6.37(SWDIO) ; also sheet 8,9
TWI_SCL: U5.23(SCL/SCLK) U6.32(P0.18) ; also sheet 8,9
TWI_SDA: U5.24(SDA/SDI) U6.31(P0.17) ; also sheet 8,9
TX: J17.2 U6.26(P0.12) ; also sheet 8,9
VCC: C11.1 J17.1 J18.1 J21.P$1 U5.1(RESV) U5.8(VDDIO) U5.13(VDD) U5.22(NCS) U6.11(VDD) ; also sheet 8,9
Unconnected: U5.2(NC1) U5.3(NC2) U5.4(NC3) U5.5(NC4) U5.6(NC5) U5.7(AUX_CL) U5.12(INT) U5.14(NC6) U5.15(NC7) U5.16(NC8) U5.17(NC9) U5.19(RESV1) U5.21(AUX_DA) U5.25(PAD) U6.9(DEC4) U6.10(DCC) U6.38(P0.22) U6.40(P0.24) U6.41(P0.23)

### Notes on the sheet
- MDBT40-256R
- Headers

## Library data of the parts
C1-C12 = SparkFun-Capacitors:CAP: Capacitor Standard 0603 ceramic capacitor, and 0.1" leaded capacitor.
J1 J2 J8 J9 J15 J16 = SparkFun-Connectors_2:M08: Header 8 Standard 8-pin 0.1" header. Use with straight break away headers (SKU : PRT-00116), right angle break away headers (PRT-00553), swiss pins (PRT-00743), machine pins (PRT-00117), and female headers (PRT-00115).; PROD_ID: CONN-08438
J3-J5 J10-J12 J17-J19 = SparkFun-Connectors_2:M04: Header 4 Standard 4-pin 0.1" header. Use with straight break away headers (SKU : PRT-00116), right angle break away headers (PRT-00553), swiss pins (PRT-00743), machine pins (PRT-00117), and female headers (PRT-00115). Molex polarized connector foot print use with SKU : PRT-08231 with associated crimp pins and housings. 1MM SMD Version SKU: PRT-10208; PROD_ID: CONN-09696
J6 J7 J13 J14 J20 J21 = SparkFun-Connectors 2:M01_SMD: Header 1 Standard 1-pin 0.1" header. Use with straight break away headers (SKU : PRT-00116), right angle break away headers (PRT-00553), swiss pins (PRT-00743), machine pins (PRT-00117), and female headers (PRT-00115). SMTSO-256-ET is a "flush mount" nut for a 4-40 screw. The older package used to be too tight, and did not allow it to sit properly thru the drill hit. The latest (0.165DIA) fits nice and snug.
J22-J33 = SparkFun-Connectors 2:M01: Header 1 Standard 1-pin 0.1" header. Use with straight break away headers (SKU : PRT-00116), right angle break away headers (PRT-00553), swiss pins (PRT-00743), machine pins (PRT-00117), and female headers (PRT-00115). SMTSO-256-ET is a "flush mount" nut for a 4-40 screw. The older package used to be too tight, and did not allow it to sit properly thru the drill hit. The latest (0.165DIA) fits nice and snug.
Q1-Q3 = crystal:FC-12M: kHz RANGE CRYSTAL UNIT LOW PROFILE SMD Source: Epson Toyocom FC-12M.pdf
U1 U4 U6 = MDBT42:MDBT42
U2 U3 U5 = invensense:MPU-9250

## Board
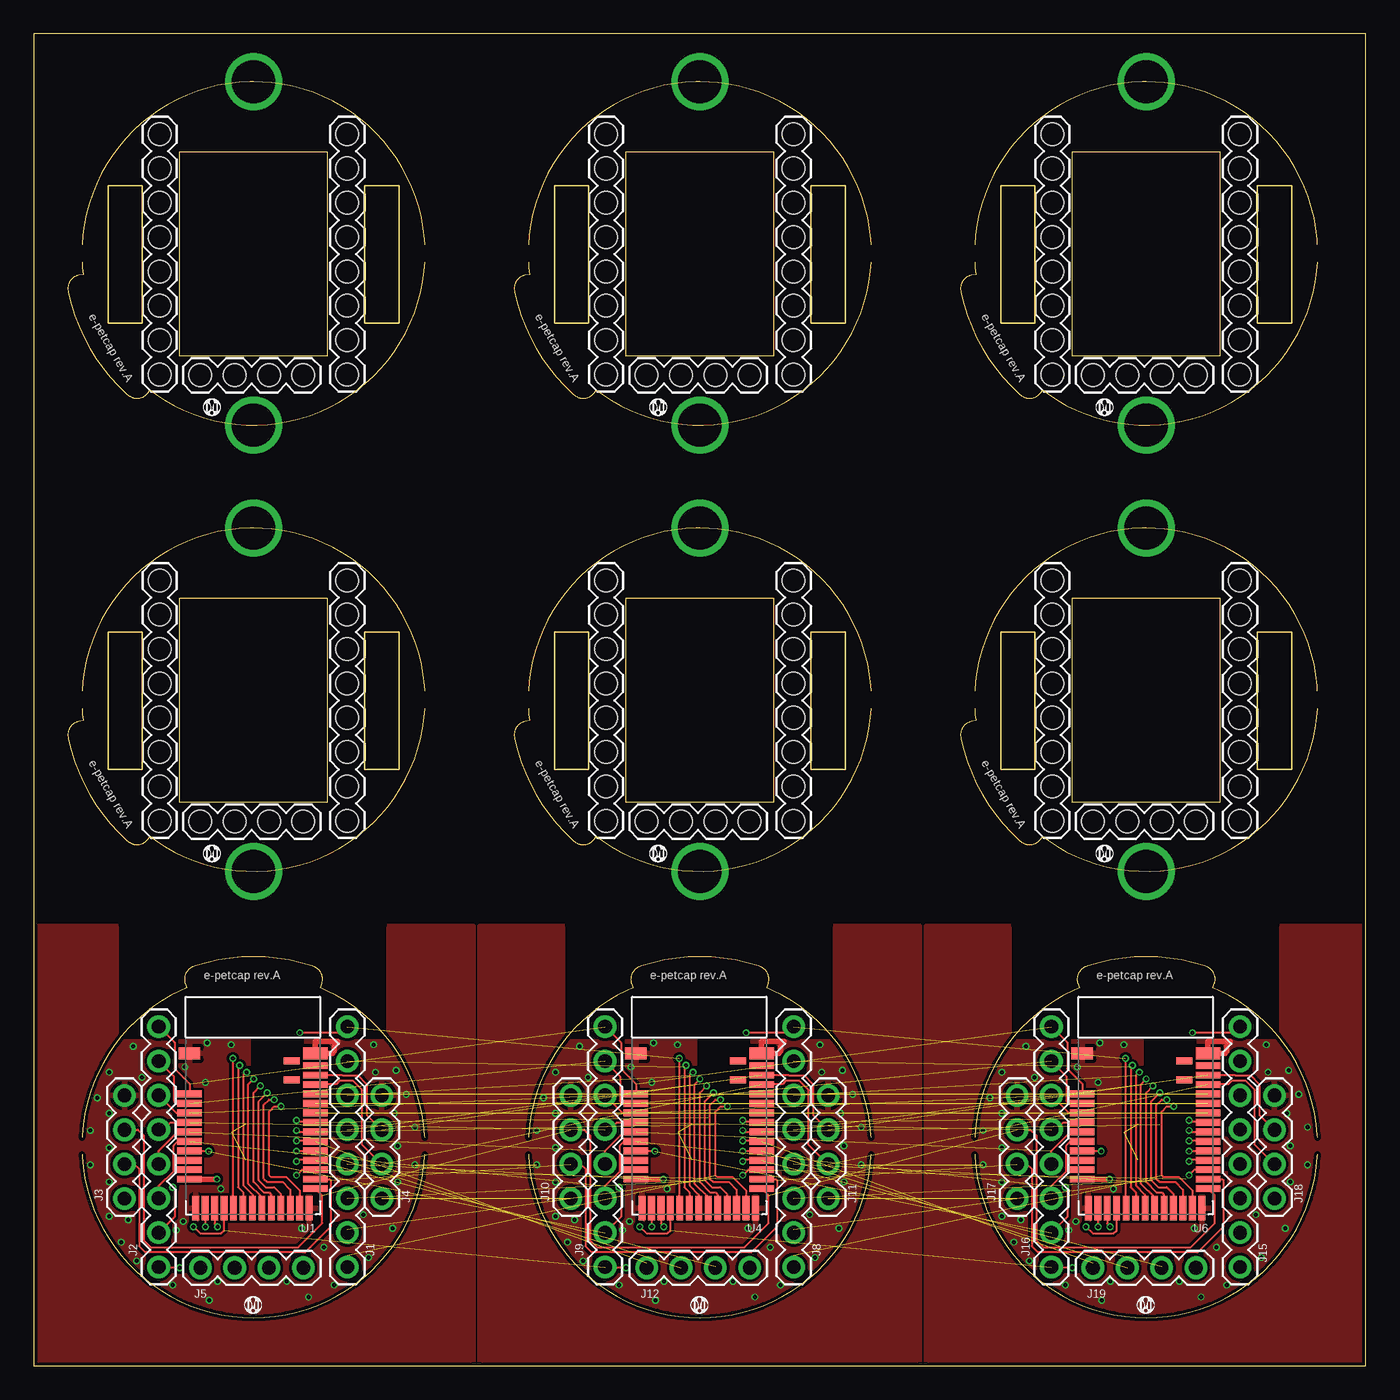
[diagram p9: board, top side]
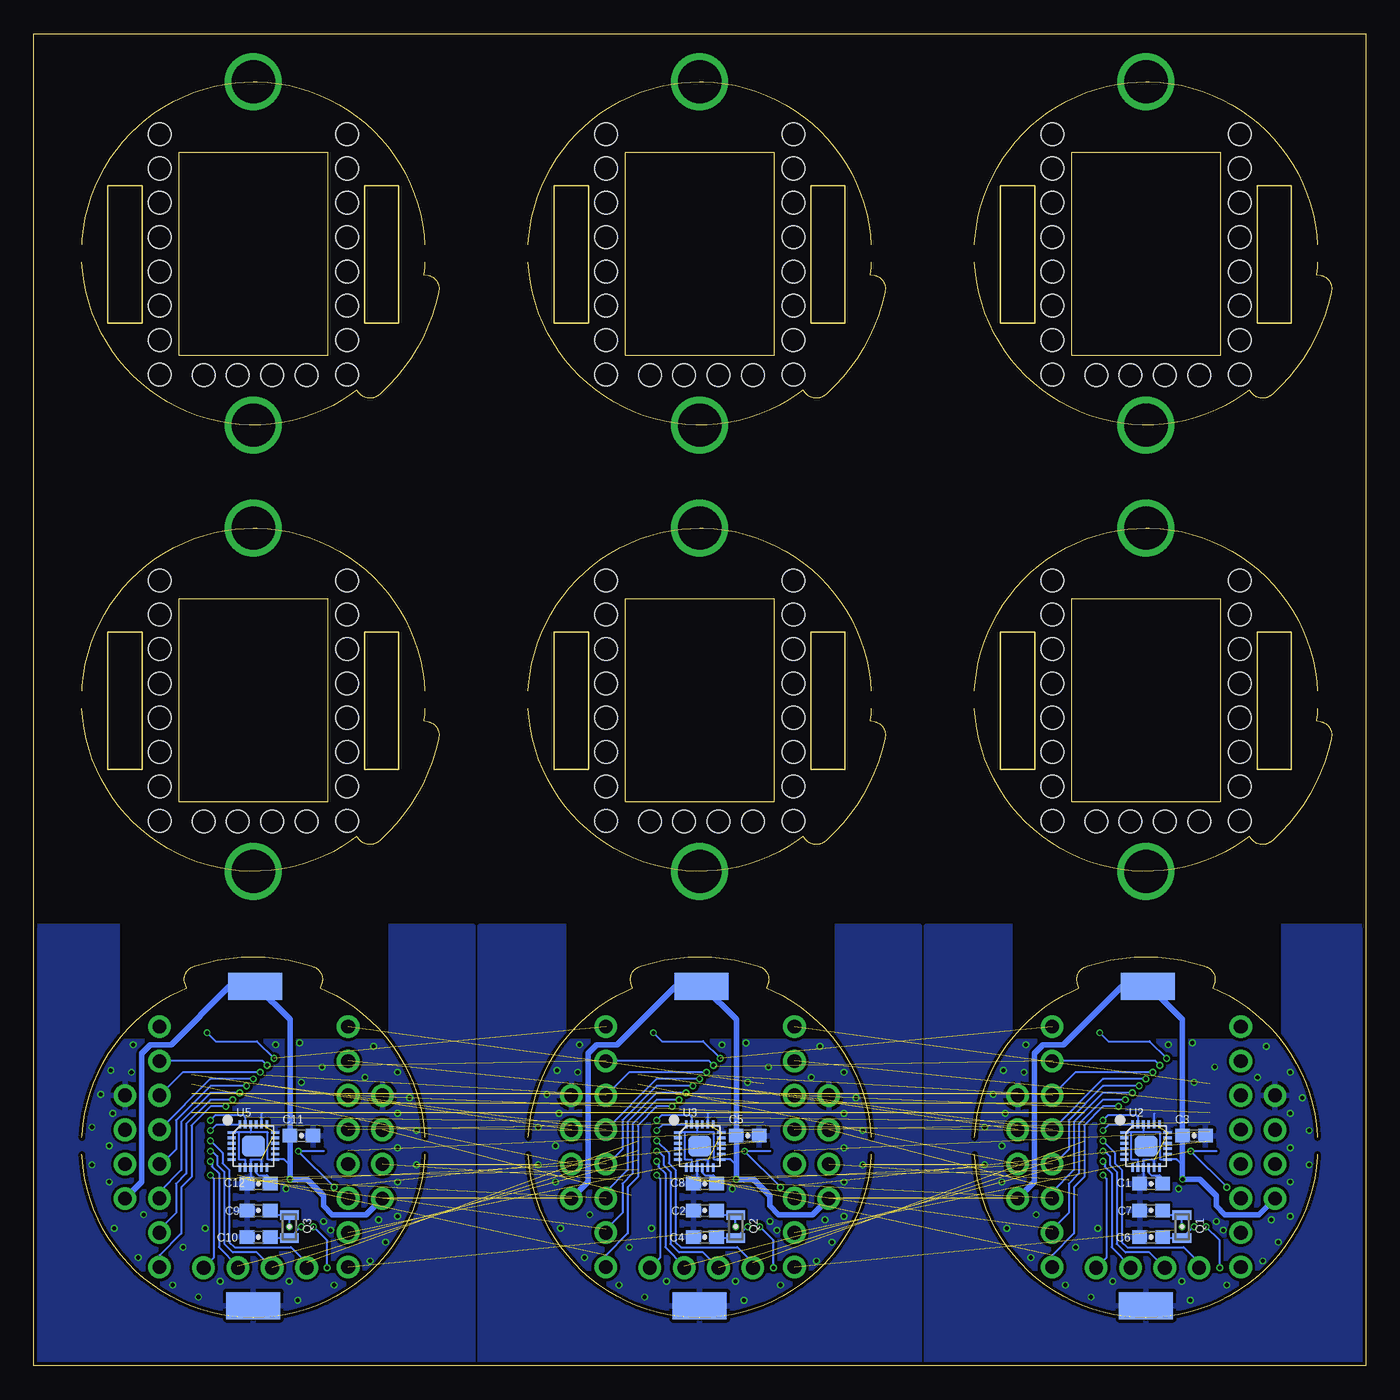
[diagram p10: board, bottom side, seen from below]

Size 98.54 x 98.54 mm. Coordinates in mm from the lower left corner, seen from the top.
Outline: 1374 segments
Copper layers (1*2*15*16): Top 0.035mm / dielectric 0.2mm / Route2 0.0175mm / dielectric 0.3mm / Route15 0.0175mm / dielectric 0.2mm / Bottom 0.035mm
Design rules "SeeedStudio_4layer_DRU_no_angle_20140221": minimum track width 8mil, minimum drill 12mil, track to track 8mil, track to pad 8mil, pad to pad 8mil, via to via 8mil, smd to smd 0mil, copper to edge 10mil, drill to drill 8mil, minimum pad ring 6mil, minimum via ring 4mil, stop-mask expansion 4mil, vias tented up to drill 25mil, thermal gap 10mil
tRestrict: area 6.3,20.2 to 26,32.5; area 39.4,20.2 to 59.1,32.5; area 72.4,20.2 to 92.1,32.5
bRestrict: area 6.3,24.3 to 26,32.5; area 39.4,24.3 to 59.1,32.5; area 72.4,24.3 to 92.1,32.5

### Footprints (pad centres in the part's own frame; a part is rotated, then mirrored left to right if it is on the bottom)
0603-CAP = smd 1.1 x 1: 1 -0.85,0; 2 0.85,0
1X08 = drill 1.016 pad 1.676: 1 0,0; 2 2.54,0; 3 5.08,0; 4 7.62,0; 5 10.16,0; 6 12.7,0; 7 15.24,0; 8 17.78,0
1X04 = drill 1.016 pad 1.676: 1 0,0; 2 2.54,0; 3 5.08,0; 4 7.62,0
1X01_SMD = smd 4 x 2: P$1 0,0
1X01_BIG = drill 3.2 pad 3.81: 1 0,0
FC-12M = smd 0.7 x 1.4: 1 -0.85,0; 2 0.85,0
MDBT42 = smd 1.6 x 0.9: 1 0.35,11.8 | smd 1.8 x 0.5: 2 0.35,8.8; 3 0.35,8.1; 4 0.35,7.4; 5 0.35,6.7; 6 0.35,6; 7 0.35,5.3; 8 0.35,4.6; 9 0.35,3.9; 10 0.35,3.2; 11 0.35,2.5; 25 9.65,1.8; 26 9.65,2.5; 27 9.65,3.2; 28 9.65,3.9; 29 9.65,4.6; 30 9.65,5.3; 31 9.65,6; 32 9.65,6.7; 33 9.65,7.4; 34 9.65,8.1; 35 9.65,8.8; 36 9.65,9.5; 37 9.65,10.2; 38 9.65,10.9 | smd 0.5 x 1.8: 12 0.8,0.35; 13 1.5,0.35; 14 2.2,0.35; 15 2.9,0.35; 16 3.6,0.35; 17 4.3,0.35; 18 5,0.35; 19 5.7,0.35; 20 6.4,0.35; 21 7.1,0.35; 22 7.8,0.35; 23 8.5,0.35; 24 9.2,0.35 | smd 1.8 x 0.9: 39 9.65,11.8 | smd 1.2 x 0.5: 40 7.9,11.25; 41 7.9,9.85
LEAD-QFN24 = smd 0.6 x 0.2: 1 -1.6,1; 2 -1.6,0.6; 3 -1.6,0.2; 4 -1.6,-0.2; 5 -1.6,-0.6; 6 -1.6,-1; 13 1.6,-1; 14 1.6,-0.6; 15 1.6,-0.2; 16 1.6,0.2; 17 1.6,0.6; 18 1.6,1 | smd 0.2 x 0.6: 7 -1,-1.6; 8 -0.6,-1.6; 9 -0.2,-1.6; 10 0.2,-1.6; 11 0.6,-1.6; 12 1,-1.6; 19 1,1.6; 20 0.6,1.6; 21 0.2,1.6; 22 -0.2,1.6; 23 -0.6,1.6; 24 -1,1.6 | smd 1.7 x 1.54: 25 0,0
1X04_HOLE = hole 1.676: 2.54,0; 5.08,0; 0,0; 7.62,0
1X08_HOLE = hole 1.676: 0,0; 2.54,0; 5.08,0; 7.62,0; 10.16,0; 12.7,0; 15.24,0; 17.78,0

### Placement (x,y rotation side)
C1  15.88,13.46 0 bottom
C2  48.9,11.49 180 bottom
C3  12.7,17.02 0 bottom
C4  48.9,9.53 180 bottom
C5  45.72,17.02 0 bottom
C6  15.88,9.53 180 bottom
C7  15.88,11.49 180 bottom
C8  48.9,13.46 0 bottom
C9  81.92,11.49 180 bottom
C10  81.92,9.53 180 bottom
C11  78.74,17.02 0 bottom
C12  81.92,13.46 0 bottom
J1  23.2,7.3 90 top
J2  9.24,7.3 90 top
J3  6.71,12.37 90 top
J4  25.75,12.37 90 top
J5  12.32,7.24 0 top
J6  16.26,4.45 0 bottom
J7  16.13,28.07 0 bottom
J8  56.22,7.3 90 top
J9  42.26,7.3 90 top
J10  39.73,12.37 90 top
J11  58.77,12.37 90 top
J12  45.34,7.24 0 top
J13  49.28,4.45 0 bottom
J14  49.15,28.07 0 bottom
J15  89.24,7.3 90 top
J16  75.28,7.3 90 top
J17  72.75,12.37 90 top
J18  91.79,12.37 90 top
J19  78.36,7.24 0 top
J20  82.3,4.45 0 bottom
J21  82.17,28.07 0 bottom
J22  16.26,36.58 0 top
J23  16.26,61.98 0 top
J24  49.28,36.58 0 top
J25  49.28,61.98 0 top
J26  82.3,36.58 0 top
J27  82.3,61.98 0 top
J28  16.26,69.6 0 top
J29  16.26,95 0 top
J30  49.28,69.6 0 top
J31  49.28,95 0 top
J32  82.3,69.6 0 top
J33  82.3,95 0 top
Q1  13.59,10.29 270 bottom
Q2  46.61,10.29 270 bottom
Q3  79.63,10.29 270 bottom
U1  11.18,11.3 0 top
U2  16.26,16.26 0 bottom
U3  49.28,16.26 0 bottom
U4  44.2,11.3 0 top
U5  82.3,16.26 0 bottom
U6  77.22,11.3 0 top
U$1  [1X04_SPACER]  6.77,45.39 90 top
U$2  [1X04_SPACER]  25.75,45.39 90 top
U$3  [1X04_HOLE]  12.32,40.26 0 top
U$4  [1X08_HOLE]  23.2,40.32 90 top
U$5  [1X08_HOLE]  9.32,40.32 90 top
U$6  [1X04_SPACER]  39.79,45.39 90 top
U$7  [1X04_SPACER]  58.77,45.39 90 top
U$8  [1X04_HOLE]  45.34,40.26 0 top
U$9  [1X08_HOLE]  56.22,40.32 90 top
U$10  [1X08_HOLE]  42.34,40.32 90 top
U$11  [1X04_SPACER]  72.81,45.39 90 top
U$12  [1X04_SPACER]  91.79,45.39 90 top
U$13  [1X04_HOLE]  78.36,40.26 0 top
U$14  [1X08_HOLE]  89.24,40.32 90 top
U$15  [1X08_HOLE]  75.36,40.32 90 top
U$16  [1X04_SPACER]  6.77,78.41 90 top
U$17  [1X04_SPACER]  25.75,78.41 90 top
U$18  [1X04_HOLE]  12.32,73.28 0 top
U$19  [1X08_HOLE]  23.2,73.34 90 top
U$20  [1X08_HOLE]  9.32,73.34 90 top
U$21  [1X04_SPACER]  39.79,78.41 90 top
U$22  [1X04_SPACER]  58.77,78.41 90 top
U$23  [1X04_HOLE]  45.34,73.28 0 top
U$24  [1X08_HOLE]  56.22,73.34 90 top
U$25  [1X08_HOLE]  42.34,73.34 90 top
U$26  [1X04_SPACER]  72.81,78.41 90 top
U$27  [1X04_SPACER]  91.79,78.41 90 top
U$28  [1X04_HOLE]  78.36,73.28 0 top
U$29  [1X08_HOLE]  89.24,73.34 90 top
U$30  [1X08_HOLE]  75.36,73.34 90 top

### Tracks (layer width: path | path; a pad name or v marks a point on that pad's centre or on a via)
A0  (via drill 0.3)  (2 unrouted)
  Top 0.152: v14.73,22.73 14.73,11.7 U1.16 | J1.8 22.76,24.64 v19.68,24.64 | v47.75,22.73 47.75,11.7 U4.16 | J8.8 55.78,24.64 v52.7,24.64 | v80.77,22.73 80.77,11.7 U6.16 | J15.8 88.8,24.64 v85.72,24.64
  Bottom 0.152: v14.73,22.73 16,24 19.05,24 v19.68,24.64 | v47.75,22.73 49.02,24 52.07,24 v52.7,24.64 | v80.77,22.73 82.04,24 85.09,24 v85.72,24.64
A1  (via drill 0.3)  (2 unrouted)
  Top 0.152: v15.24,22.23 15.11,22.1 15.11,13.21 15.48,12.85 U1.17 | v48.26,22.23 48.13,22.1 48.13,13.21 48.5,12.85 U4.17 | v81.28,22.23 81.15,22.1 81.15,13.21 81.52,12.85 U6.17
  Bottom 0.152: v15.24,22.23 15.55,22.54 J1.7 | v48.26,22.23 48.57,22.54 J8.7 | v81.28,22.23 81.59,22.54 J15.7
A2  (via drill 0.3)  (2 unrouted)
  Top 0.152: v15.75,21.72 15.49,21.46 15.49,13.34 16.18,12.65 U1.18 | v48.77,21.72 48.51,21.46 48.51,13.34 49.2,12.65 U4.18 | v81.79,21.72 81.53,21.46 81.53,13.34 82.22,12.65 U6.18
  Bottom 0.152: v15.75,21.72 21.48,21.72 J1.6 | v48.77,21.72 54.5,21.72 J8.6 | v81.79,21.72 87.52,21.72 J15.6
A3  (via drill 0.3)  (2 unrouted)
  Top 0.152: v16.26,21.21 15.88,20.83 15.88,13.46 16.89,12.45 16.89,11.67 U1.19 | v49.28,21.21 48.9,20.83 48.9,13.46 49.91,12.45 49.91,11.67 U4.19 | v82.3,21.21 81.92,20.83 81.92,13.46 82.93,12.45 82.93,11.67 U6.19
  Bottom 0.152: v16.26,21.21 19.45,21.21 J1.5 | v49.28,21.21 52.47,21.21 J8.5 | v82.3,21.21 85.49,21.21 J15.5
A4  (via drill 0.3)  (2 unrouted)
  Top 0.152: 17.53,11.7 U1.20 17.58,12.65 17.4,12.83 17.02,12.83 16.26,13.59 16.26,20.19 v16.76,20.7 | 50.55,11.7 U4.20 50.6,12.65 50.42,12.83 50.04,12.83 49.28,13.59 49.28,20.19 v49.78,20.7 | 83.57,11.7 U6.20 83.62,12.65 83.44,12.83 83.06,12.83 82.3,13.59 82.3,20.19 v82.8,20.7
  Bottom 0.152: v16.76,20.7 19.43,20.7 21.97,18.16 21.97,16 23.05,14.92 J1.4 | v49.78,20.7 52.45,20.7 54.99,18.16 54.99,16 56.07,14.92 J8.4 | v82.8,20.7 85.47,20.7 88.01,18.16 88.01,16 89.09,14.92 J15.4
A5  (via drill 0.3)  (2 unrouted)
  Top 0.152: 18.29,11.66 U1.21 18.28,12.71 17.78,13.21 17.14,13.21 16.64,13.72 16.64,19.56 v17.27,20.19 | 51.31,11.66 U4.21 51.3,12.71 50.8,13.21 50.16,13.21 49.66,13.72 49.66,19.56 v50.29,20.19 | 84.33,11.66 U6.21 84.32,12.71 83.82,13.21 83.19,13.21 82.68,13.72 82.68,19.56 v83.31,20.19
  Bottom 0.152: v17.27,20.19 19.43,20.19 21.59,18.03 21.59,14.48 23.2,12.87 J1.3 | v50.29,20.19 52.45,20.19 54.61,18.03 54.61,14.48 56.22,12.87 J8.3 | v83.31,20.19 85.47,20.19 87.63,18.03 87.63,14.48 89.24,12.87 J15.3
A6  (via drill 0.3)  (2 unrouted)
  Top 0.152: 18.92,11.71 U1.22 18.98,13.03 18.41,13.59 17.27,13.59 17.02,13.84 17.02,19.3 17.4,19.68 v17.78,19.68 | 51.94,11.71 U4.22 52,13.03 51.44,13.59 50.29,13.59 50.04,13.84 50.04,19.3 50.42,19.68 v50.8,19.68 | 84.96,11.71 U6.22 85.02,13.03 84.45,13.59 83.31,13.59 83.06,13.84 83.06,19.3 83.44,19.68 v83.82,19.68
  Bottom 0.152: v17.78,19.68 19.43,19.68 21.21,17.91 21.21,14.22 21.97,13.46 21.97,11.3 23.2,10.08 J1.2 | v50.8,19.68 52.45,19.68 54.23,17.91 54.23,14.22 54.99,13.46 54.99,11.3 56.22,10.08 J8.2 | v83.82,19.68 85.47,19.68 87.25,17.91 87.25,14.22 88.01,13.46 88.01,11.3 89.24,10.08 J15.2
A7  (via drill 0.3)  (2 unrouted)
  Top 0.152: 19.56,11.77 U1.23 19.68,12.96 18.67,13.97 17.53,13.97 17.4,14.1 17.4,18.8 17.78,19.18 v18.29,19.18 | 52.58,11.77 U4.23 52.7,12.96 51.69,13.97 50.55,13.97 50.42,14.1 50.42,18.8 50.8,19.18 v51.31,19.18 | 85.6,11.77 U6.23 85.72,12.96 84.71,13.97 83.57,13.97 83.44,14.1 83.44,18.8 83.82,19.18 v84.33,19.18
  Bottom 0.152: v18.29,19.18 19.43,19.18 20.83,17.78 20.83,13.97 21.59,13.21 21.59,9.78 23.2,8.17 J1.1 | v51.31,19.18 52.45,19.18 53.85,17.78 53.85,13.97 54.61,13.21 54.61,9.78 56.22,8.17 J8.1 | v84.33,19.18 85.47,19.18 86.87,17.78 86.87,13.97 87.63,13.21 87.63,9.78 89.24,8.17 J15.1
D0  (2 unrouted)
  Top 0.152: J2.8 10.41,23.91 10.41,21.97 11.53,20.86 U1.2 | J9.8 43.43,23.91 43.43,21.97 44.55,20.86 U4.2 | J16.8 76.45,23.91 76.45,21.97 77.57,20.86 U6.2
D1  (2 unrouted)
  Top 0.152: J2.7 10.35,21.42 10.35,19.61 10.57,19.4 U1.3 | J9.7 43.37,21.42 43.37,19.61 43.59,19.4 U4.3 | J16.7 76.39,21.42 76.39,19.61 76.61,19.4 U6.3
D2  (2 unrouted)
  Top 0.152: J2.6 10.54,18.7 U1.4 | J9.6 43.56,18.7 U4.4 | J16.6 76.58,18.7 U6.4
D3  (2 unrouted)
  Top 0.152: J2.5 9.59,17.46 10.13,18 U1.5 | J9.5 42.6,17.46 43.15,18 U4.5 | J16.5 75.62,17.46 76.17,18 U6.5
D4  (2 unrouted)
  Top 0.152: J2.4 9.24,15.9 10.6,17.27 11.49,17.27 U1.6 | J9.4 42.26,15.9 43.62,17.27 44.52,17.27 U4.6 | J16.4 75.28,15.9 76.64,17.27 77.53,17.27 U6.6
D5  (2 unrouted)
  Top 0.152: J2.3 9.24,13.3 10.35,14.39 10.35,16.29 10.63,16.6 U1.7 | J9.3 42.26,13.3 43.37,14.39 43.37,16.29 43.65,16.6 U4.7 | J16.3 75.28,13.3 76.39,14.39 76.39,16.29 76.67,16.6 U6.7
D6  (via drill 0.3)  (2 unrouted)
  Top 0.152: v12.93,15.88 11.53,15.88 U1.8 | J2.2 10.41,11.01 10.41,13.08 v10.29,13.21 | v45.95,15.88 44.55,15.88 U4.8 | J9.2 43.43,11.01 43.43,13.08 v43.31,13.21 | v78.97,15.88 77.57,15.88 U6.8 | J16.2 76.45,11.01 76.45,13.08 v76.33,13.21
  Bottom 0.152: 11.05,15.88 v12.93,15.88 10.29,13.23 v10.29,13.21 | 44.07,15.88 v45.95,15.88 43.31,13.23 v43.31,13.21 | 77.09,15.88 v78.97,15.88 76.33,13.23 v76.33,13.21
D7  (via drill 0.3)  (2 unrouted)
  Top 0.152: J2.1 10.73,7.3 v10.79,7.24 | U1.15 14.08,10.01 13.84,9.78 12.32,9.78 v11.81,10.29 | J9.1 43.76,7.3 v43.81,7.24 | U4.15 47.1,10.01 46.86,9.78 45.34,9.78 v44.83,10.29 | J16.1 76.78,7.3 v76.83,7.24 | U6.15 80.12,10.01 79.88,9.78 78.36,9.78 v77.85,10.29
  Bottom 0.152: v10.79,7.24 10.79,9.27 v11.81,10.29 | v43.81,7.24 43.81,9.27 v44.83,10.29 | v76.83,7.24 76.83,9.27 v77.85,10.29
GND  (via drill 0.3)  (8 unrouted)
  Top 0.406: U1.39 20.83,23.11 | 20.83,23.11 20.83,24 22.48,24 22.23,23.62 22.23,23.24 22.1,23.11 20.83,23.11 | U4.39 53.85,23.11 | 53.85,23.11 53.85,24 55.5,24 55.24,23.62 55.24,23.24 55.12,23.11 53.85,23.11 | U6.39 86.87,23.11 | 86.87,23.11 86.87,24 88.52,24 88.27,23.62 88.27,23.24 88.14,23.11 86.87,23.11
  Bottom 0.152: U2.11 15.66,15.24 16.46,15.24 U2.9 16.46,13.34 C1.1 | U2.20 15.66,18.63 15.62,18.67 | U3.11 48.68,15.24 49.48,15.24 U3.9 49.48,13.34 C8.1 | U3.20 48.68,18.63 48.64,18.67 | U5.11 81.7,15.24 82.5,15.24 U5.9 82.5,13.34 C12.1 | U5.20 81.7,18.63 81.66,18.67
  other vias: 10.29,5.97 7.62,7.75 6.48,9.14 5.59,11.05 6.99,10.79 5.59,13.59 5.59,16.13 5.59,18.67 5.59,21.72 7.37,23.62 8,21.34 12.7,20.95 12.83,23.88 11.18,22.1 14.61,23.75 25.27,21.72 25.15,23.75 26.8,21.84 28.19,17.65 26.92,16.26 26.92,13.59 26.54,10.16 28.19,14.86 26.67,18.67 4.7,19.81 4.19,17.4 4.19,14.86 27.56,20.07 20.32,5.08 19.81,10.16 10.54,10.03 11.05,10.67 22.23,5.97 21.46,8.76 13.6,6.24 18.72,6.24 12.97,4.84 24.77,8 24.38,11.18 13.84,13.08 43.31,5.97 40.64,7.75 39.5,9.14 38.61,11.05 40.01,10.79 38.61,13.59 38.61,16.13 38.61,18.67 38.61,21.72 40.39,23.62 41.02,21.34 45.72,20.95 45.85,23.88 44.2,22.1 47.62,23.75 58.29,21.72 58.17,23.75 59.82,21.84 61.21,17.65 59.94,16.26 59.94,13.59 59.56,10.16 61.21,14.86 59.69,18.67 37.72,19.81 37.21,17.4 37.21,14.86 60.58,20.07 53.34,5.08 52.83,10.16 43.56,10.03 44.07,10.67 55.24,5.97 54.48,8.76 46.62,6.24 51.74,6.24 45.99,4.84 57.78,8 57.4,11.18 46.86,13.08 76.33,5.97 73.66,7.75 72.52,9.14 71.63,11.05 73.03,10.79 71.63,13.59 71.63,16.13 71.63,18.67 71.63,21.72 73.41,23.62 74.04,21.34 78.74,20.95 78.87,23.88 77.22,22.1 80.64,23.75 91.31,21.72 91.19,23.75 92.84,21.84 94.23,17.65 92.96,16.26 92.96,13.59 92.58,10.16 94.23,14.86 92.71,18.67 70.74,19.81 70.23,17.4 70.23,14.86 93.6,20.07 86.36,5.08 85.85,10.16 76.58,10.03 77.09,10.67 88.27,5.97 87.5,8.76 79.64,6.24 84.76,6.24 79.01,4.84 90.81,8 90.42,11.18 79.88,13.08
  pour Top: 0,32.5 32.5,32.5 32.5,0 0,0
  pour Bottom: 0,32.5 32.5,32.5 32.5,0 0,0
  pour Top: 33.02,32.5 65.52,32.5 65.52,0 33.02,0
  pour Bottom: 33.02,32.5 65.52,32.5 65.52,0 33.02,0
  pour Top: 66.04,32.5 98.54,32.5 98.54,0 66.04,0
  pour Bottom: 66.04,32.5 98.54,32.5 98.54,0 66.04,0
LED0  (2 unrouted)
LED1  (2 unrouted)
N$2  (via drill 0.3)
  Top 0.152: U1.14 13.38,10.5 v13.59,10.29
  Bottom 0.152: v13.59,10.29 Q1.1 14.8,11.14 C7.1
N$3  (via drill 0.3)
  Top 0.152: U1.13 12.68,10.31 v12.7,10.29
  Bottom 0.152: v12.7,10.29 12.74,10.29 Q1.2 14.99,9.44 C6.1
N$5
  Bottom 0.152: U2.10 16.06,14.28 15.88,14.1 15.24,14.1 15.11,13.97 15.11,13.42 C1.2
N$64  (via drill 0.3)
  Top 0.152: U4.14 46.4,10.5 v46.61,10.29
  Bottom 0.152: v46.61,10.29 Q2.1 47.82,11.14 C2.1
N$100  (via drill 0.3)
  Top 0.152: U4.13 45.7,10.31 v45.72,10.29
  Bottom 0.152: v45.72,10.29 45.76,10.29 Q2.2 48.01,9.44 C4.1
N$101
  Bottom 0.152: U3.10 49.08,14.28 48.9,14.1 48.26,14.1 48.13,13.97 48.13,13.42 C8.2
N$107  (via drill 0.3)
  Top 0.152: U6.14 79.42,10.5 v79.63,10.29
  Bottom 0.152: v79.63,10.29 Q3.1 80.83,11.14 C9.1
N$108  (via drill 0.3)
  Top 0.152: U6.13 78.72,10.31 v78.74,10.29
  Bottom 0.152: v78.74,10.29 78.78,10.29 Q3.2 81.03,9.44 C10.1
N$109
  Bottom 0.152: U5.10 82.1,14.28 81.92,14.1 81.28,14.1 81.15,13.97 81.15,13.42 C12.2
NRESET  (2 unrouted)
RX  (2 unrouted)
  Top 0.152: U1.25 21.34,12.59 21.34,10.54 19.56,8.76 8.64,8.76 8.14,9.28 8.14,17.03 7.69,17.45 J3.3 | U4.25 54.36,12.59 54.36,10.54 52.58,8.76 41.66,8.76 41.16,9.28 41.16,17.03 40.71,17.45 J10.3 | U6.25 87.38,12.59 87.38,10.54 85.6,8.76 74.68,8.76 74.18,9.28 74.18,17.03 73.73,17.45 J17.3
SPI_MISO  (via drill 0.3)  (2 unrouted)
  Top 0.152: v19.43,15.88 19.46,15.9 U1.29 | v52.45,15.88 52.48,15.9 U4.29 | v85.47,15.88 85.5,15.9 U6.29
  Bottom 0.152: J5.2 16,8.38 17.78,8.38 18.41,9.02 18.41,14.35 18.92,14.86 18.92,15.49 19.3,15.88 v19.43,15.88 | J12.2 49.02,8.38 50.8,8.38 51.44,9.02 51.44,14.35 51.94,14.86 51.94,15.49 52.32,15.88 v52.45,15.88 | J19.2 82.04,8.38 83.82,8.38 84.45,9.02 84.45,14.35 84.96,14.86 84.96,15.49 85.34,15.88 v85.47,15.88
SPI_MOSI  (via drill 0.3)  (2 unrouted)
  Top 0.152: U1.27 19.84,14.5 v19.43,14.1 | U4.27 52.86,14.5 v52.45,14.1 | U6.27 85.88,14.5 v85.47,14.1
  Bottom 0.152: 19.68,7.49 J5.4 19.18,8 19.18,13.84 v19.43,14.1 | 52.7,7.49 J12.4 52.2,8 52.2,13.84 v52.45,14.1 | 85.72,7.49 J19.4 85.22,8 85.22,13.84 v85.47,14.1
SPI_SCK  (via drill 0.3)  (2 unrouted)
  Top 0.152: U1.28 20.79,15.24 19.56,15.24 v19.43,15.11 | U4.28 53.81,15.24 52.58,15.24 v52.45,15.11 | U6.28 86.83,15.24 85.6,15.24 v85.47,15.11
  Bottom 0.152: v19.43,15.11 19.3,14.99 19.3,14.73 18.8,14.22 18.8,8.76 17.4,7.37 J5.3 | v52.45,15.11 52.32,14.99 52.32,14.73 51.82,14.22 51.82,8.76 50.42,7.37 J12.3 | v85.47,15.11 85.34,14.99 85.34,14.73 84.84,14.22 84.84,8.76 83.44,7.37 J19.3
SPI_SS  (via drill 0.3)  (2 unrouted)
  Top 0.152: U1.30 20.79,16.64 v19.43,16.64 | U4.30 53.81,16.64 v52.45,16.64 | U6.30 86.83,16.64 v85.47,16.64
  Bottom 0.152: v19.43,16.64 18.54,15.75 18.54,14.99 18.03,14.48 18.03,9.14 17.65,8.76 13.46,8.76 12.32,7.62 J5.1 | v52.45,16.64 51.56,15.75 51.56,14.99 51.05,14.48 51.05,9.14 50.67,8.76 46.48,8.76 45.34,7.62 J12.1 | v85.47,16.64 84.58,15.75 84.58,14.99 84.07,14.48 84.07,9.14 83.69,8.76 79.5,8.76 78.36,7.62 J19.1
SWCLK  (2 unrouted)
  Top 0.152: J4.2 25.73,14.91 24.31,16.33 24.31,20.4 23.62,21.08 22.61,21.08 22.35,20.83 20.85,20.83 U1.36 | J11.2 58.74,14.91 57.33,16.33 57.33,20.4 56.64,21.08 55.63,21.08 55.37,20.83 53.87,20.83 U4.36 | J18.2 91.77,14.91 90.35,16.33 90.35,20.4 89.66,21.08 88.65,21.08 88.39,20.83 86.89,20.83 U6.36
SWDIO  (2 unrouted)
  Top 0.152: J4.3 24.64,18.56 24.64,20.83 24,21.46 22.86,21.46 22.82,21.5 U1.37 | J11.3 57.66,18.56 57.66,20.83 57.02,21.46 55.88,21.46 55.84,21.5 U4.37 | J18.3 90.68,18.56 90.68,20.83 90.04,21.46 88.9,21.46 88.86,21.5 U6.37
TWI_SCL  (via drill 0.3)  (2 unrouted)
  Top 0.152: U1.32 20.8,18.03 19.56,18.03 v19.43,18.16 | U4.32 53.81,18.03 52.58,18.03 v52.45,18.16 | U6.32 86.83,18.03 85.6,18.03 v85.47,18.16
  Bottom 0.152: v19.43,18.16 19.05,18.54 17.02,18.54 16.86,18.38 U2.23 | v52.45,18.16 52.07,18.54 50.04,18.54 49.88,18.38 U3.23 | v85.47,18.16 85.09,18.54 83.06,18.54 82.9,18.38 U5.23
TWI_SDA  (via drill 0.3)  (2 unrouted)
  Top 0.152: U1.31 20.8,17.27 19.56,17.27 v19.43,17.4 | U4.31 53.81,17.27 52.58,17.27 v52.45,17.4 | U6.31 86.83,17.27 85.6,17.27 v85.47,17.4
  Bottom 0.152: v19.43,17.4 18.97,17.86 U2.24 | v52.45,17.4 51.99,17.86 U3.24 | v85.47,17.4 85.01,17.86 U5.24
TX  (2 unrouted)
  Top 0.152: U1.26 21.88,13.8 21.97,13.72 21.97,10.29 20.07,8.38 8.26,8.38 7.79,8.85 7.79,14.57 7.44,14.91 J3.2 | U4.26 54.9,13.8 54.99,13.72 54.99,10.29 53.09,8.38 41.27,8.38 40.8,8.85 40.8,14.57 40.46,14.91 J10.2 | U6.26 87.92,13.8 88.01,13.72 88.01,10.29 86.11,8.38 74.3,8.38 73.83,8.85 73.83,14.57 73.48,14.91 J17.2
VCC  (via drill 0.3)  (2 unrouted)
  Top 0.406: U1.11 11.56,13.77 11.59,13.8 v13.55,13.8 | U4.11 44.58,13.77 44.61,13.8 v46.57,13.8 | U6.11 77.6,13.77 77.63,13.8 v79.59,13.8
  Bottom 0.152: U2.22 16.46,17.26 | 16.46,17.26 17.32,17.26 | 17.32,17.26 U2.1 | U2.8 16.86,15.24 17.32,15.24 17.32,17.26 | 16.46,17.26 15.19,17.26 15.19,15.24 14.78,15.24 U2.13 13.99,15.26 13.55,14.82 C3.1 | U3.22 49.48,17.26 | 49.48,17.26 50.34,17.26 | 50.34,17.26 U3.1 | U3.8 49.88,15.24 50.34,15.24 50.34,17.26 | 49.48,17.26 48.21,17.26 48.21,15.24 47.8,15.24 U3.13 47.01,15.26 46.57,14.82 C5.1 | U5.22 82.5,17.26 | 82.5,17.26 83.36,17.26 | 83.36,17.26 U5.1 | U5.8 82.9,15.24 83.36,15.24 83.36,17.26 | 82.5,17.26 81.23,17.26 81.23,15.24 80.82,15.24 U5.13 80.03,15.26 79.59,14.82 C11.1
  Bottom 0.406: J3.1 7.91,11.18 10.41,11.18 11.05,11.81 11.05,12.57 12.28,13.8 v13.55,13.8 C3.1 13.55,25.61 16,28.07 J7.P$1 18.03,28.07 22.35,23.75 23.88,23.75 24.51,23.11 24.51,13.61 J4.1 | J10.1 40.93,11.18 43.43,11.18 44.07,11.81 44.07,12.57 45.3,13.8 v46.57,13.8 C5.1 46.57,25.61 49.02,28.07 J14.P$1 51.05,28.07 55.37,23.75 56.9,23.75 57.53,23.11 57.53,13.61 J11.1 | J17.1 73.95,11.18 76.45,11.18 77.09,11.81 77.09,12.57 78.32,13.8 v79.59,13.8 C11.1 79.59,25.61 82.04,28.07 J21.P$1 84.07,28.07 88.39,23.75 89.92,23.75 90.55,23.11 90.55,13.61 J18.1

### Text on the board
tPlace: e-petcap rev.A | e-petcap rev.A | e-petcap rev.A | e-petcap rev.A | e-petcap rev.A | e-petcap rev.A | e-petcap rev.A | e-petcap rev.A | e-petcap rev.A